# EAGLE design oresat-proto-card-Octavo (EAGLE 9.4.0)

## Sheet 1 of 3: Connectors
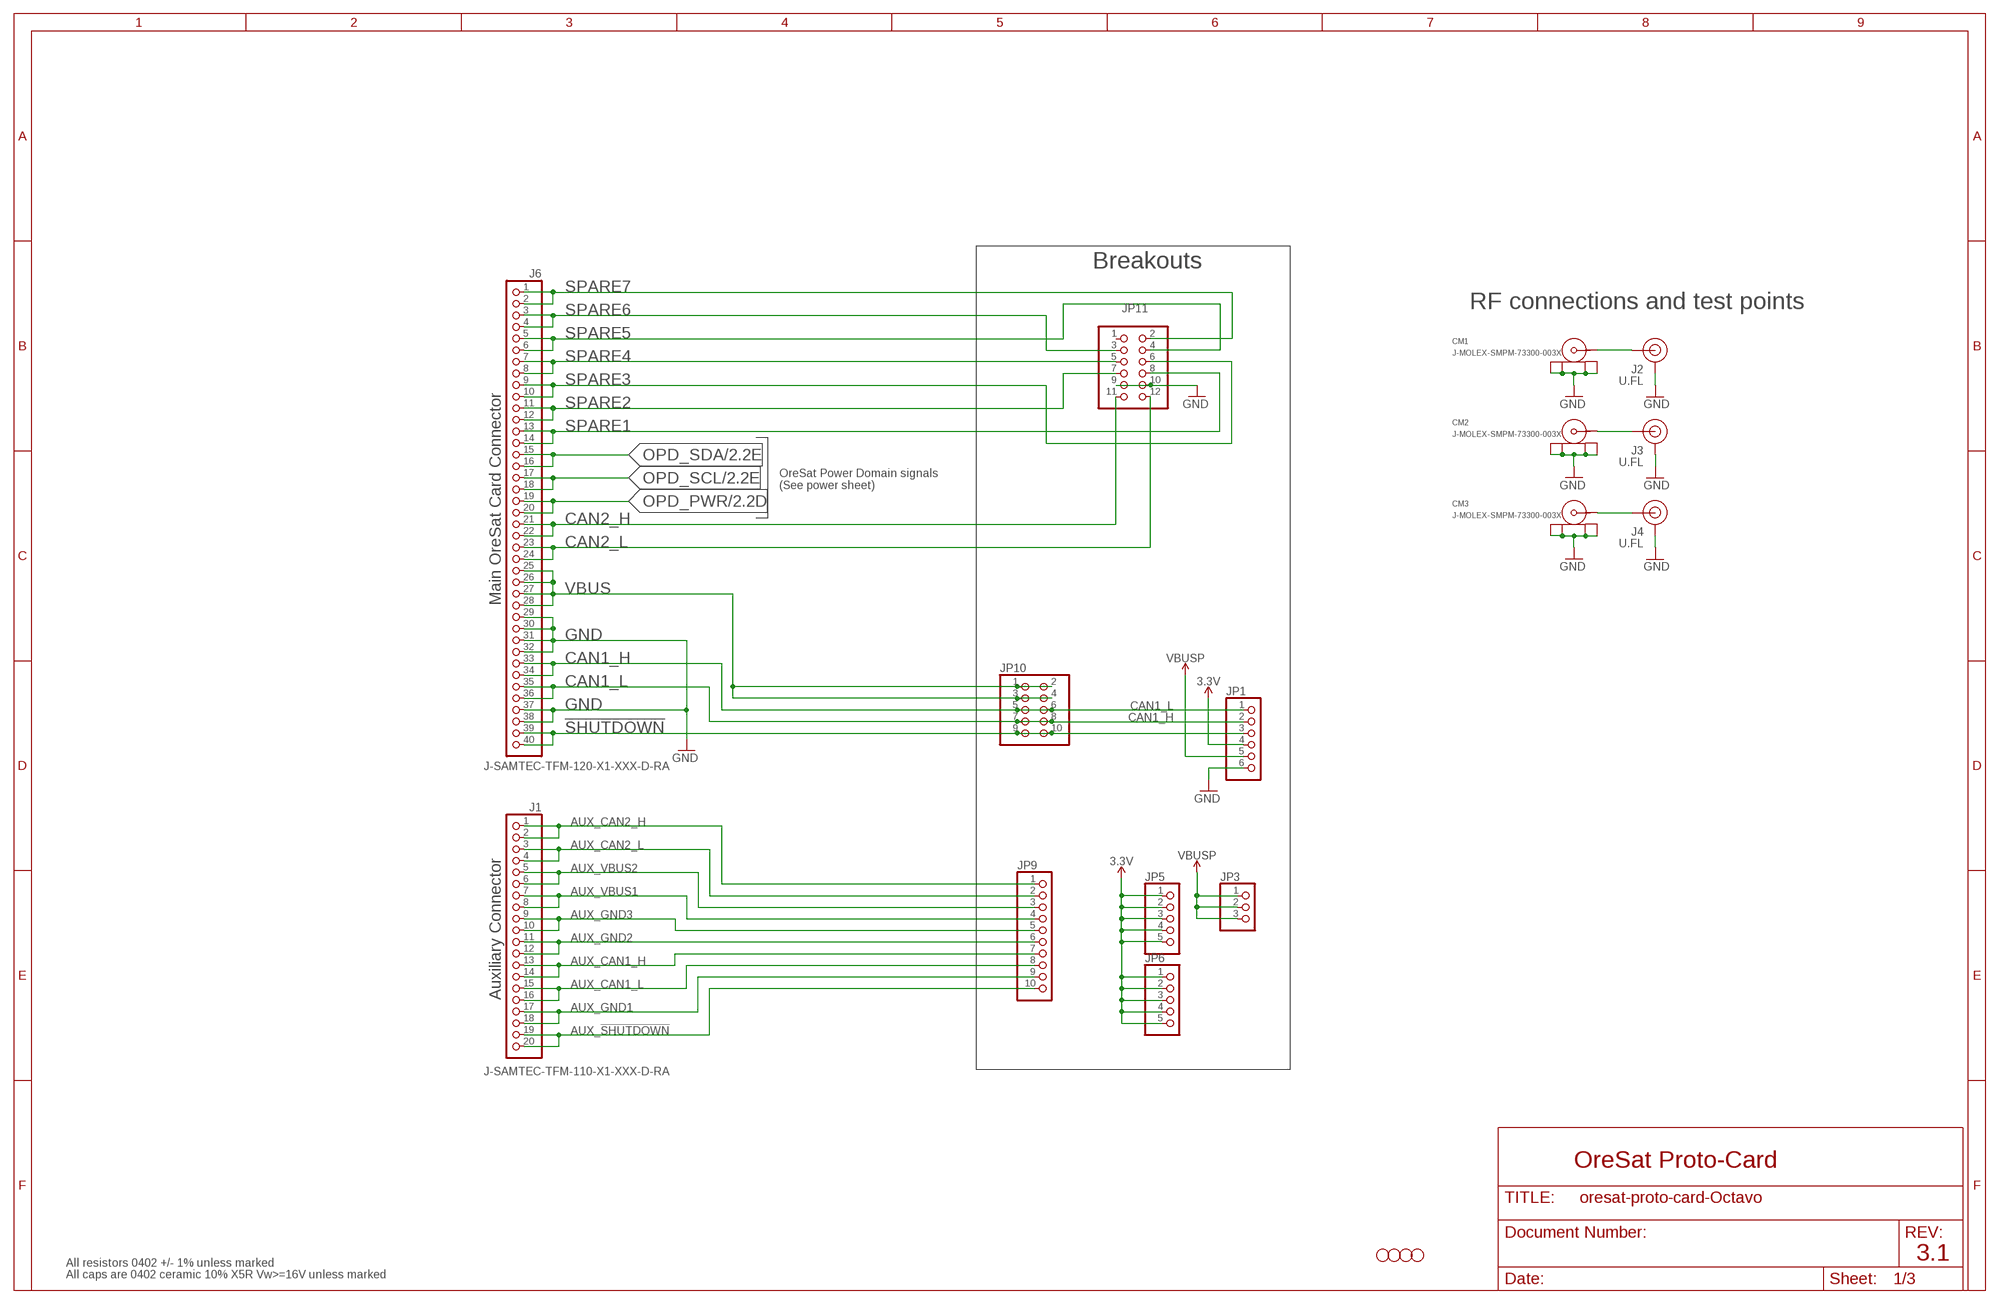
[diagram p0: schematic, sheet 1]

### Parts
CM1  J-MOLEX-SMPM-73300-003X  [J-MOLEX-SMPM-073300-003X]
CM2  J-MOLEX-SMPM-73300-003X  [J-MOLEX-SMPM-073300-003X]
CM3  J-MOLEX-SMPM-73300-003X  [J-MOLEX-SMPM-073300-003X]
H1  STAND-OFFTIGHT  [STAND-OFF-TIGHT]
H2  STAND-OFFTIGHT  [STAND-OFF-TIGHT]
H3  STAND-OFFTIGHT  [STAND-OFF-TIGHT]
H4  STAND-OFFTIGHT  [STAND-OFF-TIGHT]
J1  J-SAMTEC-TFM-110-X1-XXX-D-RA  [J-SAMTEC-TFM-110-X1-XXX-D-RA]
J2  U.FL  U.FL2PIN  [U.FL]
J3  U.FL  U.FL2PIN  [U.FL]
J4  U.FL  U.FL2PIN  [U.FL]
J6  J-SAMTEC-TFM-120-X1-XXX-D-RA  [J-SAMTEC-TFM-120-X1-XXX-D-RA]
JP1  PINHD-1X6  [1X06]
JP3  PINHD-1X3  [1X03]
JP5  PINHD-1X5  [1X05]
JP6  PINHD-1X5  [1X05]
JP9  PINHD-1X10  [1X10]
JP10  PINHD-2X5  [2X05]
JP11  PINHD-2X6  [2X06]

### Nets
3.3V: JP1.4 JP5.1 JP5.2 JP5.3 JP5.4 JP5.5 JP6.1 JP6.2 JP6.3 JP6.4 JP6.5 ; also sheet 2,3
!SHUTDOWN: J6.39 J6.40 JP1.3 JP10.9 JP10.10
AUX_!SHUTDOWN: J1.19 J1.20 JP9.10
AUX_CAN1_H: J1.13 J1.14 JP9.7
AUX_CAN1_L: J1.15 J1.16 JP9.8
AUX_CAN2_H: J1.1 J1.2 JP9.1
AUX_CAN2_L: J1.3 J1.4 JP9.2
AUX_GND1: J1.17 J1.18 JP9.9
AUX_GND2: J1.11 J1.12 JP9.6
AUX_GND3: J1.9 J1.10 JP9.5
AUX_VBUS1: J1.7 J1.8 JP9.4
AUX_VBUS2: J1.5 J1.6 JP9.3
CAN1_H: J6.33 J6.34 JP1.1 JP10.5 JP10.6 ; also sheet 3
CAN1_L: J6.35 J6.36 JP1.2 JP10.7 JP10.8 ; also sheet 3
CAN2_H: J6.21 J6.22 JP11.11
CAN2_L: J6.23 J6.24 JP11.12
GND: CM1.P$1(SHIELD3) CM1.P$2(SHIELD2) CM1.P$3(SHIELD1) CM1.P$4(SHIELD) CM2.P$1(SHIELD3) CM2.P$2(SHIELD2) CM2.P$3(SHIELD1) CM2.P$4(SHIELD) CM3.P$1(SHIELD3) CM3.P$2(SHIELD2) CM3.P$3(SHIELD1) CM3.P$4(SHIELD) J2.1(GND) J2.2(GND) J3.1(GND) J3.2(GND) J4.1(GND) J4.2(GND) J6.29 J6.30 J6.31 J6.32 J6.37 J6.38 JP1.6 JP11.9 JP11.10 ; also sheet 2,3
N$300: CM3.RF(CENTER) J4.FEED(SIGNAL)
OPD_PWR: J6.19 J6.20 ; also sheet 2
OPD_SCL: J6.17 J6.18 ; also sheet 2
OPD_SDA: J6.15 J6.16 ; also sheet 2
RF1: CM1.RF(CENTER) J2.FEED(SIGNAL)
RF2: CM2.RF(CENTER) J3.FEED(SIGNAL)
SPARE1: J6.13 J6.14 JP11.8
SPARE2: J6.11 J6.12 JP11.7
SPARE3: J6.9 J6.10 JP11.6
SPARE4: J6.7 J6.8 JP11.5
SPARE5: J6.5 J6.6 JP11.4
SPARE6: J6.3 J6.4 JP11.3
SPARE7: J6.1 J6.2 JP11.2
VBUS: J6.25 J6.26 J6.27 J6.28 JP10.1 JP10.2 JP10.3 JP10.4 ; also sheet 2
VBUSP: JP1.5 JP3.1 JP3.2 JP3.3 ; also sheet 2,3
Unconnected: JP11.1

### Notes on the sheet
- Breakouts
- RF connections and test points
- OreSat Power Domain signals
  (See power sheet)
- Main OreSat Card Connector
- Auxiliary Connector
- OreSat Proto-Card
- 3.1
- All resistors 0402 +/- 1% unless marked
- All caps are 0402 ceramic 10% X5R Vw>=16V unless marked

## Sheet 2 of 3: Power
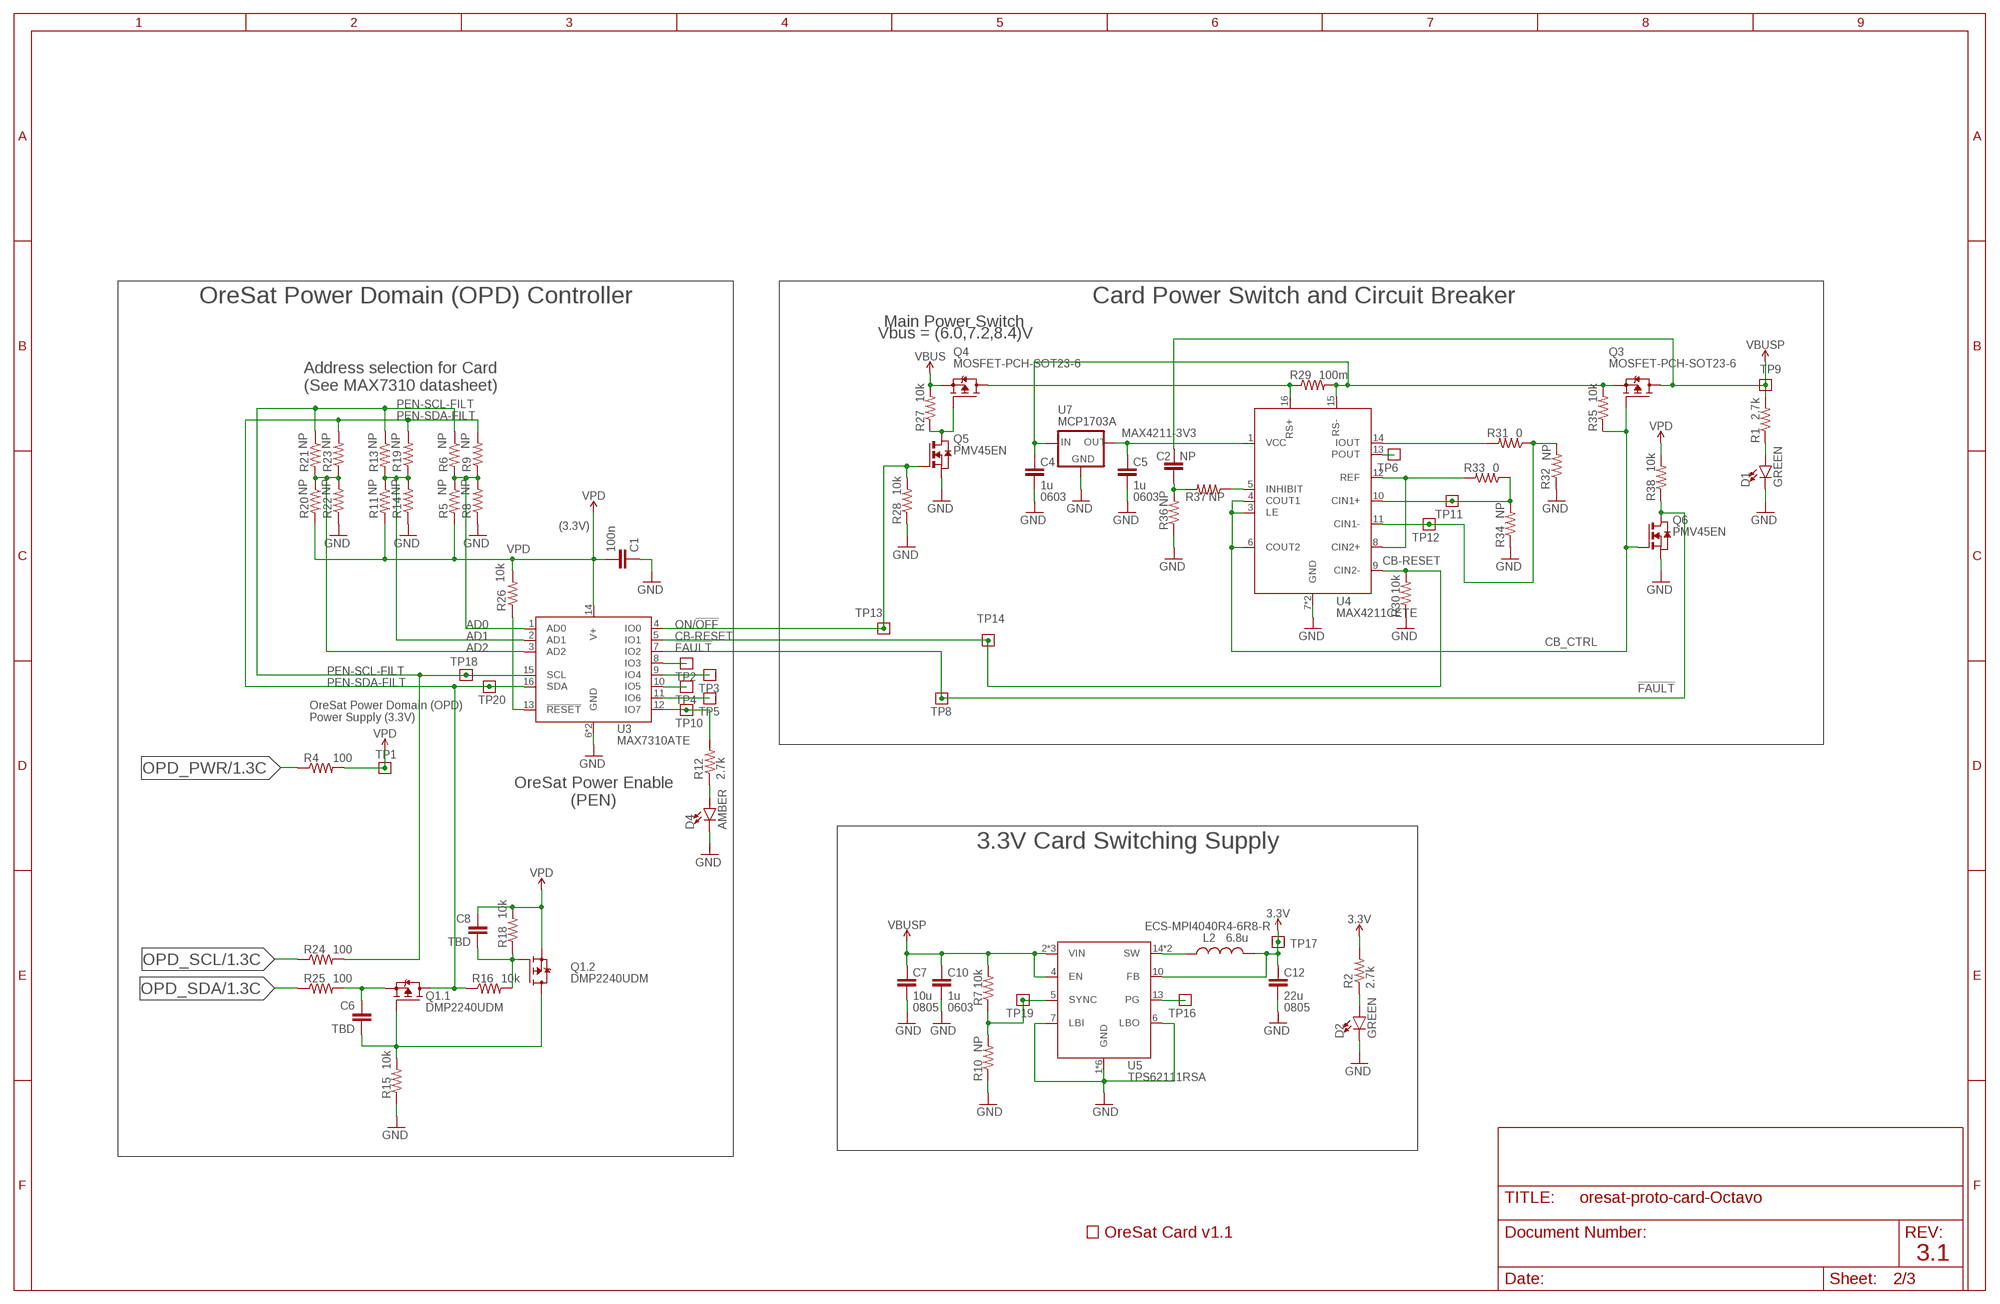
[diagram p1: schematic, sheet 2]

### Parts
C1  100n  C-EU0402-B-NOSILK  [.0402-B-NOSILK]
C2  NP  C-EU0402-B-NOSILK  [.0402-B-NOSILK]
C4  1u  C-EU0603-B-NOSILK  [.0603-B-NOSILK]
C5  1u  C-EU0603-B-NOSILK  [.0603-B-NOSILK]
C6  TBD  C-EU0402-B-NOSILK  [.0402-B-NOSILK]
C7  10u  C-EU0805-B-NOSILK  [.0805-B-NOSILK]
C8  TBD  C-EU0402-B-NOSILK  [.0402-B-NOSILK]
C10  1u  C-EU0603-B-NOSILK  [.0603-B-NOSILK]
C12  22u  C-EU0805-B-NOSILK  [.0805-B-NOSILK]
D1  GREEN  LED-GREEN0603  [LED-0603]
D2  GREEN  LED-GREEN0603  [LED-0603]
D4  AMBER  LED-GREEN0603  [LED-0603]
L2  6.8u  L-ECS-MPI4040  [ECS-MPI4040]
Q1  DMP2240UDM  MOSFET-PCH-SOT23-6  [SOT23-6]
Q3  MOSFET-PCH-SOT23-6  [SOT23-6]
Q4  MOSFET-PCH-SOT23-6  [SOT23-6]
Q5  PMV45EN  [SOT23]
Q6  PMV45EN  [SOT23]
R1  2.7k  R-US_0402-B-NOSILK  [.0402-B-NOSILK]
R2  2.7k  R-US_0402-B-NOSILK  [.0402-B-NOSILK]
R4  100  R-US_0402-B-NOSILK  [.0402-B-NOSILK]
R5  NP  R-US_0402-B-NOSILK  [.0402-B-NOSILK]
R6  NP  R-US_0402-B-NOSILK  [.0402-B-NOSILK]
R7  10k  R-US_0402-B-NOSILK  [.0402-B-NOSILK]
R8  NP  R-US_0402-B-NOSILK  [.0402-B-NOSILK]
R9  NP  R-US_0402-B-NOSILK  [.0402-B-NOSILK]
R10  NP  R-US_0402-B-NOSILK  [.0402-B-NOSILK]
R11  NP  R-US_0402-B-NOSILK  [.0402-B-NOSILK]
R12  2.7k  R-US_0402-B-NOSILK  [.0402-B-NOSILK]
R13  NP  R-US_0402-B-NOSILK  [.0402-B-NOSILK]
R14  NP  R-US_0402-B-NOSILK  [.0402-B-NOSILK]
R15  10k  R-US_0402-B-NOSILK  [.0402-B-NOSILK]
R16  10k  R-US_0402-B-NOSILK  [.0402-B-NOSILK]
R18  10k  R-US_0402-B-NOSILK  [.0402-B-NOSILK]
R19  NP  R-US_0402-B-NOSILK  [.0402-B-NOSILK]
R20  NP  R-US_0402-B-NOSILK  [.0402-B-NOSILK]
R21  NP  R-US_0402-B-NOSILK  [.0402-B-NOSILK]
R22  NP  R-US_0402-B-NOSILK  [.0402-B-NOSILK]
R23  NP  R-US_0402-B-NOSILK  [.0402-B-NOSILK]
R24  100  R-US_0402-B-NOSILK  [.0402-B-NOSILK]
R25  100  R-US_0402-B-NOSILK  [.0402-B-NOSILK]
R26  10k  R-US_0402-B-NOSILK  [.0402-B-NOSILK]
R27  10k  R-US_0402-B-NOSILK  [.0402-B-NOSILK]
R28  10k  R-US_0402-B-NOSILK  [.0402-B-NOSILK]
R29  100m  R-US_R1206  [R1206]
R30  10k  R-US_0402-B-NOSILK  [.0402-B-NOSILK]
R31  0  R-US_0402-B-NOSILK  [.0402-B-NOSILK]
R32  NP  R-US_0402-B-NOSILK  [.0402-B-NOSILK]
R33  0  R-US_0402-B-NOSILK  [.0402-B-NOSILK]
R34  NP  R-US_0402-B-NOSILK  [.0402-B-NOSILK]
R35  10k  R-US_0402-B-NOSILK  [.0402-B-NOSILK]
R36  NP  R-US_0402-B-NOSILK  [.0402-B-NOSILK]
R37  NP  R-US_0402-B-NOSILK  [.0402-B-NOSILK]
R38  10k  R-US_0402-B-NOSILK  [.0402-B-NOSILK]
TP1  TEST-POINT  [2MM-TEST-POINT]
TP2  TEST-POINT  [2MM-TEST-POINT]
TP3  TEST-POINT  [2MM-TEST-POINT]
TP4  TEST-POINT  [2MM-TEST-POINT]
TP5  TEST-POINT  [2MM-TEST-POINT]
TP6  TEST-POINT  [2MM-TEST-POINT]
TP8  TEST-POINT  [2MM-TEST-POINT]
TP9  TEST-POINT  [2MM-TEST-POINT]
TP10  TEST-POINT  [2MM-TEST-POINT]
TP11  TEST-POINT  [2MM-TEST-POINT]
TP12  TEST-POINT  [2MM-TEST-POINT]
TP13  TEST-POINT  [2MM-TEST-POINT]
TP14  TEST-POINT  [2MM-TEST-POINT]
TP16  TEST-POINT  [2MM-TEST-POINT]
TP17  TEST-POINT  [2MM-TEST-POINT]
TP18  TEST-POINT  [2MM-TEST-POINT]
TP19  TEST-POINT  [2MM-TEST-POINT]
TP20  TEST-POINT  [2MM-TEST-POINT]
U3  MAX7310ATE  MAX7310  [QFN65P400X400X80-17T210]
U4  MAX4211CETE  MAX4211  [QFN65P400X400X80-17T210]
U5  TPS62111RSA  TPS6211X  [S-PVQFN-16]
U7  MCP1703A  XC63FPM  [SOT23]
U$1  ORESAT-CARD-V1.1-3XRF  [ORESAT-CARD-V1.1-3XRF]

### Nets
3.3V: C12.1 L2.2 R2.2 TP17.1 U5.10(FB) ; also sheet 1,3
!FAULT: Q6.3(D) R38.1 TP8.1 U3.7(IO2)
AD0: R5.1 R6.2 R8.2 R9.1 U3.1(AD0)
AD1: R11.1 R13.2 R14.2 R19.1 U3.2(AD1)
AD2: R20.1 R21.2 R22.2 R23.1 U3.3(AD2)
CB-RESET: R30.2 TP14.1 U3.5(IO1) U4.9(CIN2-)
CB_CTRL: Q3.3(G) Q6.1(G) R35.1 U4.3(LE) U4.4(COUT1) U4.6(COUT2)
GND: C1.1 C4.2 C5.2 C7.2 C10.2 C12.2 D1.C D2.C D4.C Q5.2(S) Q6.2(S) R8.1 R10.1 R14.1 R15.1 R22.1 R28.1 R30.1 R32.1 R34.1 R36.1 U3.6(GND) U3.EPAD(GND) U4.7(GND) U4.EPAD(GND) U5.1(GND) U5.6(LBO) U5.7(LBI) U5.9(GND) U5.11(GND) U5.12(GND) U5.16(GND) U5.PAD(GND) U7.1(GND) ; also sheet 1,3
MAX4211-3V3: C5.1 U4.1(VCC) U7.2(OUT)
N$270: D1.A R1.1
N$271: D2.A R2.1
N$398: C4.1 Q3.4(S) R29.2 R35.2 U4.15(RS-) U7.3(IN)
N$480: TP2.1 U3.8(IO3)
N$482: TP3.1 U3.9(IO4)
N$518: TP4.1 U3.10(IO5)
N$523: TP5.1 U3.11(IO6)
N$573: R12.2 TP10.1 U3.12(IO7)
N$575: D4.A R12.1
N$579: C6.1 Q1.5(.1:S) R25.2
N$580: C6.2 Q1.1(.1:G) Q1.4(.2:D) R15.2
N$581: C8.2 Q1.3(.2:G) R16.2 R18.1
N$589: R26.1 U3.13(!RESET)
N$590: Q4.3(G) Q5.3(D) R27.1
N$593: Q4.1(D) Q4.2(D) Q4.5(D) Q4.6(D) R29.1 U4.16(RS+)
N$596: R31.1 R32.2 TP12.1 U4.11(CIN1-)
N$597: R33.1 R34.2 TP11.1 U4.10(CIN1+)
N$598: R31.2 U4.14(IOUT)
N$599: R33.2 U4.8(CIN2+) U4.12(REF)
N$600: TP6.1 U4.13(POUT)
N$603: C2.1 R36.2 R37.2
N$604: R37.1 U4.5(INHIBIT)
ON/!OFF: Q5.1(G) R28.2 TP13.1 U3.4(IO0)
OPD_PWR: R4.1 ; also sheet 1
OPD_SCL: R24.1 ; also sheet 1
OPD_SDA: R25.1 ; also sheet 1
PEN-SCL-FILT: R6.1 R13.1 R21.1 R24.2 TP18.1 U3.15(SCL)
PEN-SDA-FILT: Q1.6(.1:D) R9.2 R16.1 R19.2 R23.2 TP20.1 U3.16(SDA)
TPS62111-PG: TP16.1 U5.13(PG)
TPS62111-SYNC: R7.1 R10.2 TP19.1 U5.5(SYNC)
TPS62111_SW: L2.1 U5.14(SW) U5.15(SW)
VBUS: Q4.4(S) R27.2 ; also sheet 1
VBUSP: C2.2 C7.1 C10.1 Q3.1(D) Q3.2(D) Q3.5(D) Q3.6(D) R1.2 R7.2 TP9.1 U5.2(VIN) U5.3(VIN) U5.4(EN) U5.8(VIN) ; also sheet 1,3
VPD: C1.2 C8.1 Q1.2(.2:S) R4.2 R5.2 R11.2 R18.2 R20.2 R26.2 R38.2 TP1.1 U3.14(V+)

### Notes on the sheet
- OreSat Power Domain (OPD) Controller | Card Power Switch and Circuit Breaker
- Main Power Switch
- Vbus = (6.0,7.2,8.4)V
- Address selection for Card
  (See MAX7310 datasheet)
- 0603 | 0603
- (3.3V)
- OreSat Power Domain (OPD)
  Power Supply (3.3V)
- OreSat Power Enable
  (PEN)
- 3.3V Card Switching Supply
- ECS-MPI4040R4-6R8-R
- 0805 | 0603 | 0805
- 3.1

## Sheet 3 of 3: Microcontroller
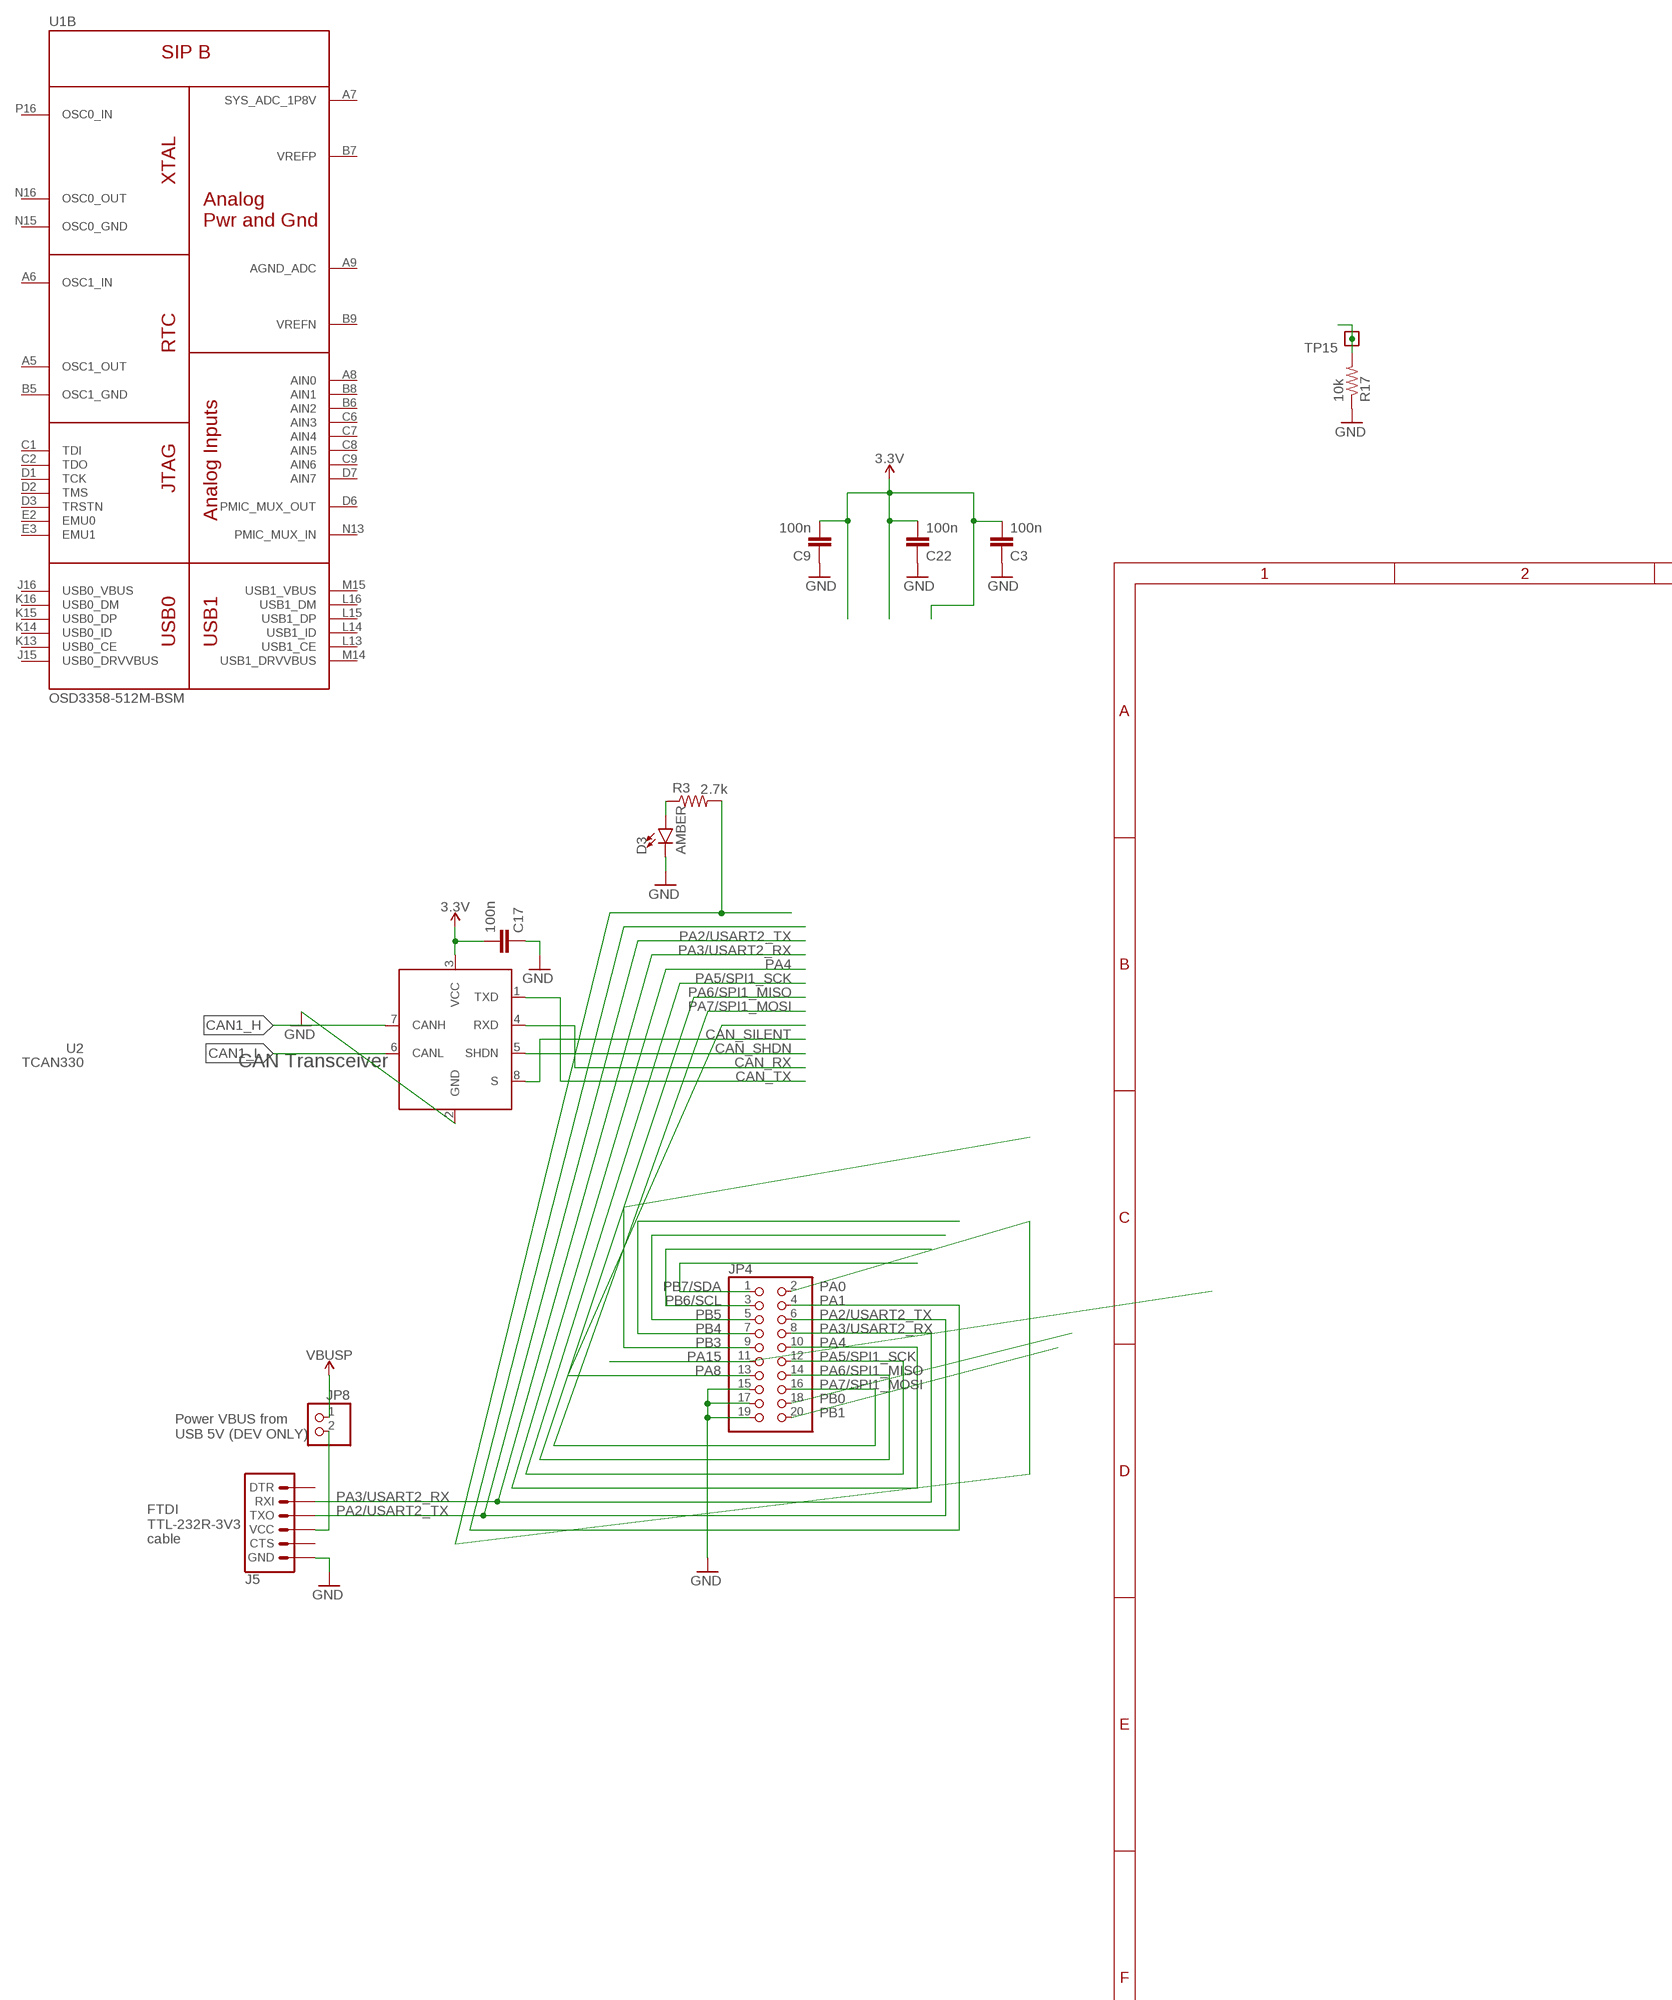
[diagram p2: schematic, sheet 3, part 1 of 2]
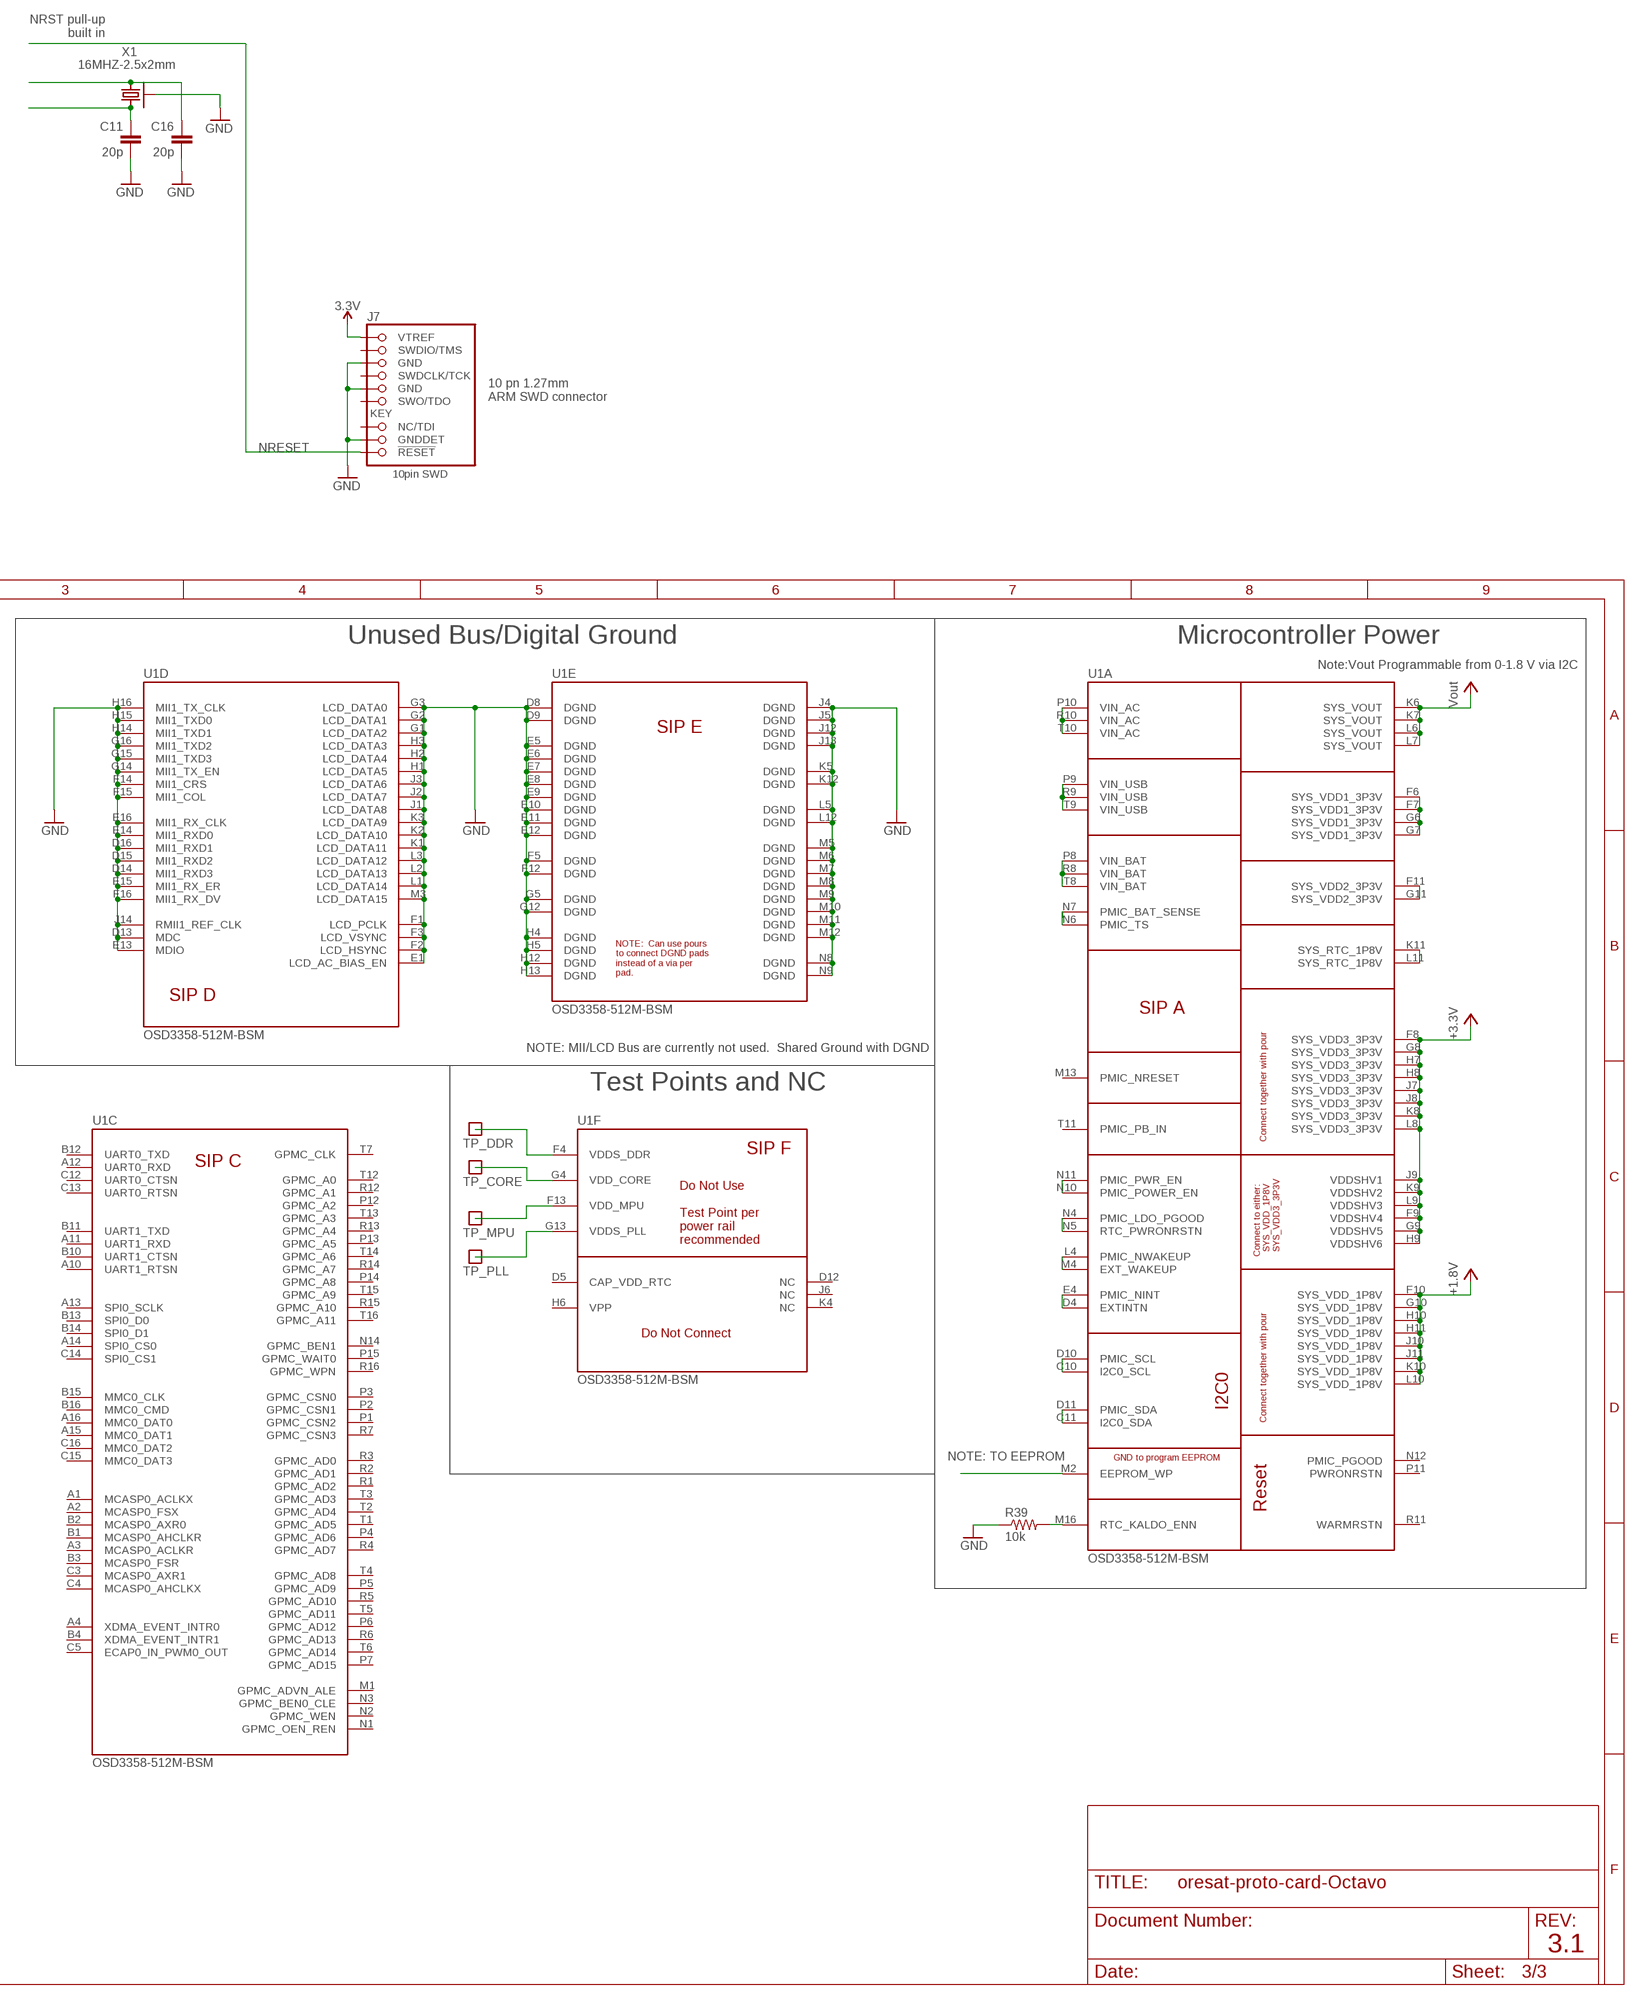
[diagram p3: schematic, sheet 3, part 2 of 2]

### Parts
C3  100n  C-EU0402-B-NOSILK  [.0402-B-NOSILK]
C9  100n  C-EU0402-B-NOSILK  [.0402-B-NOSILK]
C11  20p  C-EU0402-B-NOSILK  [.0402-B-NOSILK]
C16  20p  C-EU0402-B-NOSILK  [.0402-B-NOSILK]
C17  100n  C-EU0402-B-NOSILK  [.0402-B-NOSILK]
C22  100n  C-EU0402-B-NOSILK  [.0402-B-NOSILK]
D3  AMBER  LED-GREEN0603  [LED-0603]
J5  6_PIN_SERIAL_TARGETSILK  [6_PIN_SERIAL_TARGET_SIDE_W_SILK]
J7  FTSH-105-XX-X-DV-K  [CON10_2X5_DUK_FTSH]
JP4  PINHD-2X10  [2X10]
JP8  PINHD-1X2  [1X02]
R3  2.7k  R-US_0402-B-NOSILK  [.0402-B-NOSILK]
R17  10k  R-US_0402-B-NOSILK  [.0402-B-NOSILK]
R39  10k  R-US_R0201  [R0201]
TP15  TEST-POINT  [2MM-TEST-POINT]
TP_CORE  TEST-POINT  [2MM-TEST-POINT]
TP_DDR  TEST-POINT  [2MM-TEST-POINT]
TP_MPU  TEST-POINT  [2MM-TEST-POINT]
TP_PLL  TEST-POINT  [2MM-TEST-POINT]
U1  OSD3358-512M-BSM  [OSD335X-BGA-256]
U2  TCAN330  [SOT23-8_TI-DCN]
X1  16MHZ-2.5x2mm  CRYSTAL-WITH-GND  [CRYSTAL_2.5X2]

### Nets
3.3V: C3.2 C9.2 C17.2 C22.2 J7.1(VTREF) U2.3(VCC) ; also sheet 1,2
+3V3: U1.F8(A:SYS_VDD3_3P3V) U1.F9(A:VDDSHV4) U1.F10(A:SYS_VDD_1P8V) U1.G8(A:SYS_VDD3_3P3V) U1.G9(A:VDDSHV5) U1.G10(A:SYS_VDD_1P8V) U1.H7(A:SYS_VDD3_3P3V) U1.H8(A:SYS_VDD3_3P3V) U1.H9(A:VDDSHV6) U1.H10(A:SYS_VDD_1P8V) U1.H11(A:SYS_VDD_1P8V) U1.J7(A:SYS_VDD3_3P3V) U1.J8(A:SYS_VDD3_3P3V) U1.J9(A:VDDSHV1) U1.J10(A:SYS_VDD_1P8V) U1.J11(A:SYS_VDD_1P8V) U1.K8(A:SYS_VDD3_3P3V) U1.K9(A:VDDSHV2) U1.K10(A:SYS_VDD_1P8V) U1.L8(A:SYS_VDD3_3P3V) U1.L9(A:VDDSHV3) U1.L10(A:SYS_VDD_1P8V) ; supply symbol labelled +1.8V, +3.3V
BOOT: R17.2 TP15.1
CAN1_H: U2.7(CANH) ; also sheet 1
CAN1_L: U2.6(CANL) ; also sheet 1
CAN_RX: U2.4(RXD)
CAN_SHDN: U2.5(SHDN)
CAN_SILENT: U2.8(S)
CAN_TX: U2.1(TXD)
CRYSTALIN: C16.1 X1.1
CRYSTALOUT: C11.1 X1.3
GND: C3.1 C9.1 C11.2 C16.2 C17.1 C22.1 D3.C J5.P$6(GND) J7.3(GND) J7.5(GND) J7.9(GNDDET) JP4.15 JP4.17 JP4.19 R17.1 R39.1 U1.D8(E:DGND) U1.D9(E:DGND) U1.D13(D:MDC) U1.D14(D:MII1_RXD3) U1.D15(D:MII1_RXD2) U1.D16(D:MII1_RXD1) U1.E1(D:LCD_AC_BIAS_EN) U1.E5(E:DGND) U1.E6(E:DGND) U1.E7(E:DGND) U1.E8(E:DGND) U1.E9(E:DGND) U1.E10(E:DGND) U1.E11(E:DGND) U1.E12(E:DGND) U1.E13(D:MDIO) U1.E14(D:MII1_RXD0) U1.E15(D:MII1_RX_ER) U1.E16(D:MII1_RX_CLK) U1.F1(D:LCD_PCLK) U1.F2(D:LCD_HSYNC) U1.F3(D:LCD_VSYNC) U1.F5(E:DGND) U1.F12(E:DGND) U1.F14(D:MII1_CRS) U1.F15(D:MII1_COL) U1.F16(D:MII1_RX_DV) U1.G1(D:LCD_DATA2) U1.G2(D:LCD_DATA1) U1.G3(D:LCD_DATA0) U1.G5(E:DGND) U1.G12(E:DGND) U1.G14(D:MII1_TX_EN) U1.G15(D:MII1_TXD3) U1.G16(D:MII1_TXD2) U1.H1(D:LCD_DATA5) U1.H2(D:LCD_DATA4) U1.H3(D:LCD_DATA3) U1.H4(E:DGND) U1.H5(E:DGND) U1.H12(E:DGND) U1.H13(E:DGND) U1.H14(D:MII1_TXD1) U1.H15(D:MII1_TXD0) U1.H16(D:MII1_TX_CLK) U1.J1(D:LCD_DATA8) U1.J2(D:LCD_DATA7) U1.J3(D:LCD_DATA6) U1.J4(E:DGND) U1.J5(E:DGND) U1.J12(E:DGND) U1.J13(E:DGND) U1.J14(D:RMII1_REF_CLK) U1.K1(D:LCD_DATA11) U1.K2(D:LCD_DATA10) U1.K3(D:LCD_DATA9) U1.K5(E:DGND) U1.K12(E:DGND) U1.L1(D:LCD_DATA14) U1.L2(D:LCD_DATA13) U1.L3(D:LCD_DATA12) U1.L5(E:DGND) U1.L12(E:DGND) U1.M3(D:LCD_DATA15) U1.M5(E:DGND) U1.M6(E:DGND) U1.M7(E:DGND) U1.M8(E:DGND) U1.M9(E:DGND) U1.M10(E:DGND) U1.M11(E:DGND) U1.M12(E:DGND) U1.N8(E:DGND) U1.N9(E:DGND) U2.2(GND) X1.2(SHIELD) X1.4(SHIELD) ; also sheet 1,2
N$1: D3.A R3.1
N$2: U1.F11(A:SYS_VDD2_3P3V) U1.G11(A:SYS_VDD2_3P3V)
N$3: U1.N6(A:PMIC_TS) U1.N7(A:PMIC_BAT_SENSE)
N$4: U1.K11(A:SYS_RTC_1P8V) U1.L11(A:SYS_RTC_1P8V)
N$5: U1.D4(A:EXTINTN) U1.E4(A:PMIC_NINT)
N$6: U1.F6(A:SYS_VDD1_3P3V) U1.F7(A:SYS_VDD1_3P3V) U1.G6(A:SYS_VDD1_3P3V) U1.G7(A:SYS_VDD1_3P3V)
N$7: U1.K6(A:SYS_VOUT) U1.K7(A:SYS_VOUT) U1.L6(A:SYS_VOUT) U1.L7(A:SYS_VOUT) ; supply symbol labelled Vout
N$8: U1.P10(A:VIN_AC) U1.R10(A:VIN_AC) U1.T10(A:VIN_AC)
N$9: U1.P9(A:VIN_USB) U1.R9(A:VIN_USB) U1.T9(A:VIN_USB)
N$10: U1.P8(A:VIN_BAT) U1.R8(A:VIN_BAT) U1.T8(A:VIN_BAT)
N$11: U1.L4(A:PMIC_NWAKEUP) U1.M4(A:EXT_WAKEUP)
N$12: U1.N4(A:PMIC_LDO_PGOOD) U1.N5(A:RTC_PWRONRSTN)
N$13: U1.N10(A:PMIC_POWER_EN) U1.N11(A:PMIC_PWR_EN)
N$14: U1.C10(A:I2C0_SCL) U1.D10(A:PMIC_SCL)
N$15: U1.C11(A:I2C0_SDA) U1.D11(A:PMIC_SDA)
N$16: TP_MPU.1 U1.F13(F:VDD_MPU)
N$17: R39.2 U1.M16(A:RTC_KALDO_ENN)
N$18: U1.M2(A:EEPROM_WP)
N$19: TP_PLL.1 U1.G13(F:VDDS_PLL)
N$20: TP_CORE.1 U1.G4(F:VDD_CORE)
N$21: TP_DDR.1 U1.F4(F:VDDS_DDR)
N$406: J5.P$4(VCC) JP8.2
NRESET: J7.10(!RESET)
PA0: JP4.2 R3.2
PA1: JP4.4
PA2/USART2_TX: J5.P$2(TXO) JP4.6
PA3/USART2_RX: J5.P$3(RXI) JP4.8
PA4: JP4.10
PA5/SPI1_SCK: JP4.12
PA6/SPI1_MISO: JP4.14
PA7/SPI1_MOSI: JP4.16
PA8: JP4.13
PA15: JP4.11
PB0: JP4.18
PB1: JP4.20
PB3: JP4.9
PB4: JP4.7
PB5: JP4.5
PB6/SCL: JP4.3
PB7/SDA: JP4.1
VBUSP: JP8.1 ; also sheet 1,2
Unconnected: J5.P$1(DTR) J5.P$5(CTS) J7.2(SWDIO/TMS) J7.4(SWDCLK/TCK) J7.6(SWO/TDO) J7.8(NC/TDI) U1.A1(C:MCASP0_ACLKX) U1.A2(C:MCASP0_FSX) U1.A3(C:MCASP0_ACLKR) U1.A4(C:XDMA_EVENT_INTR0) U1.A5(B:OSC1_OUT) U1.A6(B:OSC1_IN) U1.A7(B:SYS_ADC_1P8V) U1.A8(B:AIN0) U1.A9(B:AGND_ADC) U1.A10(C:UART1_RTSN) U1.A11(C:UART1_RXD) U1.A12(C:UART0_RXD) U1.A13(C:SPI0_SCLK) U1.A14(C:SPI0_CS0) U1.A15(C:MMC0_DAT1) U1.A16(C:MMC0_DAT0) U1.B1(C:MCASP0_AHCLKR) U1.B2(C:MCASP0_AXR0) U1.B3(C:MCASP0_FSR) U1.B4(C:XDMA_EVENT_INTR1) U1.B5(B:OSC1_GND) U1.B6(B:AIN2) U1.B7(B:VREFP) U1.B8(B:AIN1) U1.B9(B:VREFN) U1.B10(C:UART1_CTSN) U1.B11(C:UART1_TXD) U1.B12(C:UART0_TXD) U1.B13(C:SPI0_D0) U1.B14(C:SPI0_D1) U1.B15(C:MMC0_CLK) U1.B16(C:MMC0_CMD) U1.C1(B:TDI) U1.C2(B:TDO) U1.C3(C:MCASP0_AXR1) U1.C4(C:MCASP0_AHCLKX) U1.C5(C:ECAP0_IN_PWM0_OUT) U1.C6(B:AIN3) U1.C7(B:AIN4) U1.C8(B:AIN5) U1.C9(B:AIN6) U1.C12(C:UART0_CTSN) U1.C13(C:UART0_RTSN) U1.C14(C:SPI0_CS1) U1.C15(C:MMC0_DAT3) U1.C16(C:MMC0_DAT2) U1.D1(B:TCK) U1.D2(B:TMS) U1.D3(B:TRSTN) U1.D5(F:CAP_VDD_RTC) U1.D6(B:PMIC_MUX_OUT) U1.D7(B:AIN7) U1.D12(F:NC) U1.E2(B:EMU0) U1.E3(B:EMU1) U1.H6(F:VPP) U1.J6(F:NC) U1.J15(B:USB0_DRVVBUS) U1.J16(B:USB0_VBUS) U1.K4(F:NC) U1.K13(B:USB0_CE) U1.K14(B:USB0_ID) U1.K15(B:USB0_DP) U1.K16(B:USB0_DM) U1.L13(B:USB1_CE) U1.L14(B:USB1_ID) U1.L15(B:USB1_DP) U1.L16(B:USB1_DM) U1.M1(C:GPMC_ADVN_ALE) U1.M13(A:PMIC_NRESET) U1.M14(B:USB1_DRVVBUS) U1.M15(B:USB1_VBUS) U1.N1(C:GPMC_OEN_REN) U1.N2(C:GPMC_WEN) U1.N3(C:GPMC_BEN0_CLE) U1.N12(A:PMIC_PGOOD) U1.N13(B:PMIC_MUX_IN) U1.N14(C:GPMC_BEN1) U1.N15(B:OSC0_GND) U1.N16(B:OSC0_OUT) U1.P1(C:GPMC_CSN2) U1.P2(C:GPMC_CSN1) U1.P3(C:GPMC_CSN0) U1.P4(C:GPMC_AD6) U1.P5(C:GPMC_AD9) U1.P6(C:GPMC_AD12) U1.P7(C:GPMC_AD15) U1.P11(A:PWRONRSTN) U1.P12(C:GPMC_A2) U1.P13(C:GPMC_A5) U1.P14(C:GPMC_A8) U1.P15(C:GPMC_WAIT0) U1.P16(B:OSC0_IN) U1.R1(C:GPMC_AD2) U1.R2(C:GPMC_AD1) U1.R3(C:GPMC_AD0) U1.R4(C:GPMC_AD7) U1.R5(C:GPMC_AD10) U1.R6(C:GPMC_AD13) U1.R7(C:GPMC_CSN3) U1.R11(A:WARMRSTN) U1.R12(C:GPMC_A1) U1.R13(C:GPMC_A4) U1.R14(C:GPMC_A7) U1.R15(C:GPMC_A10) U1.R16(C:GPMC_WPN) U1.T1(C:GPMC_AD5) U1.T2(C:GPMC_AD4) U1.T3(C:GPMC_AD3) U1.T4(C:GPMC_AD8) U1.T5(C:GPMC_AD11) U1.T6(C:GPMC_AD14) U1.T7(C:GPMC_CLK) U1.T11(A:PMIC_PB_IN) U1.T12(C:GPMC_A0) U1.T13(C:GPMC_A3) U1.T14(C:GPMC_A6) U1.T15(C:GPMC_A9) U1.T16(C:GPMC_A11)

### Notes on the sheet
- NRST pull-up
  built in
- 10 pn 1.27mm 
  ARM SWD connector
- Unused Bus/Digital Ground | Microcontroller Power
- Note:Vout Programmable from 0-1.8 V via I2C
- CAN Transceiver
- NOTE: MII/LCD Bus are currently not used.  Shared Ground with DGND
- Test Points and NC
- Power VBUS from
  USB 5V (DEV ONLY)
- NOTE: TO EEPROM
- FTDI 
  TTL-232R-3V3
  cable
- 3.1

## Library data of the parts
C1-C3 C6 C8 C9 C17 C22 = rcl_custom:C-EU: CAPACITOR, European symbol; DIS: Digi-Key; DPN: 1276-1001-1-ND; MFR: Samsung; MPN: CL05B104KO5NNNC
C4 C5 C10 = oresat-rcl:C-EU: CAPACITOR, European symbol; DIS: Digi-Key; DPN: 1276-1001-1-ND; MFR: Samsung; MPN: CL05B104KO5NNNC
C7 C12 = oresat-rcl:C-EU: CAPACITOR, European symbol
C11 C16 = rcl_custom:C-EU: CAPACITOR, European symbol; DIS: Digi-Key; DPN: 1276-6601-1-ND; MFR: Samsung; MPN: CL05C200JB51PNC
CM1-CM3 = J-Molex-SMPM-73300-003X:J-MOLEX-SMPM-73300-003X; MFR: Molex; MPN: 73300-0020
D1 D2 = SparkFun-LED:LED-GREEN: Green SMD LED Used in manufacturing of various products at SparkFun Packages: 0603 - SMD 0603 package [Product Link] <http://www.futureelectronics.com/en/technologies/semiconductors/optoelectronics/leds/Pages/9894312-LTST-C190GKT.aspx?CrossPart=HSMG-C190&IM=0> LilyPad 1206 - SMD1206 LilyPad package [Product Link] <http://www.futureelectronics.com/en/Technologies/Product.aspx?ProductID=IN150NGHARVATEKCORPORATION2049943&IM=0> 1206 - SMD1206 package [Product Link] <http://www.futureelectronics.com/en/technologies/semiconductors/optoelectronics/leds/Pages/8315665-LTST-C150KGKT.aspx?IM=0> 1206 Bottom Mount -SMD 1206 Bottom Mount [Product Link] <http://www.digikey.com/product-detail/en/lite-on-inc/LTST-C230KGKT/160-1456-1-ND/386854> SparkFun Products: Pro Mini 328 -5V <https://www.sparkfun.com/products/821> RedBoard <https://www.sparkfun.com/products/12757> MP3 Trigger <https://www.sparkfun.com/products/13720> Makey Makey <https://www.sparkfun.com/products/11076>
D3 = SparkFun-LED:LED-GREEN: Green SMD LED Used in manufacturing of various products at SparkFun Packages: 0603 - SMD 0603 package [Product Link] <http://www.futureelectronics.com/en/technologies/semiconductors/optoelectronics/leds/Pages/9894312-LTST-C190GKT.aspx?CrossPart=HSMG-C190&IM=0> LilyPad 1206 - SMD1206 LilyPad package [Product Link] <http://www.futureelectronics.com/en/Technologies/Product.aspx?ProductID=IN150NGHARVATEKCORPORATION2049943&IM=0> 1206 - SMD1206 package [Product Link] <http://www.futureelectronics.com/en/technologies/semiconductors/optoelectronics/leds/Pages/8315665-LTST-C150KGKT.aspx?IM=0> 1206 Bottom Mount -SMD 1206 Bottom Mount [Product Link] <http://www.digikey.com/product-detail/en/lite-on-inc/LTST-C230KGKT/160-1456-1-ND/386854> SparkFun Products: Pro Mini 328 -5V <https://www.sparkfun.com/products/821> RedBoard <https://www.sparkfun.com/products/12757> MP3 Trigger <https://www.sparkfun.com/products/13720> Makey Makey <https://www.sparkfun.com/products/11076>; PROD_ID: DIO-00821; VALUE: GREEN
D4 = SparkFun-LED:LED-GREEN: Green SMD LED Used in manufacturing of various products at SparkFun Packages: 0603 - SMD 0603 package [Product Link] <http://www.futureelectronics.com/en/technologies/semiconductors/optoelectronics/leds/Pages/9894312-LTST-C190GKT.aspx?CrossPart=HSMG-C190&IM=0> LilyPad 1206 - SMD1206 LilyPad package [Product Link] <http://www.futureelectronics.com/en/Technologies/Product.aspx?ProductID=IN150NGHARVATEKCORPORATION2049943&IM=0> 1206 - SMD1206 package [Product Link] <http://www.futureelectronics.com/en/technologies/semiconductors/optoelectronics/leds/Pages/8315665-LTST-C150KGKT.aspx?IM=0> 1206 Bottom Mount -SMD 1206 Bottom Mount [Product Link] <http://www.digikey.com/product-detail/en/lite-on-inc/LTST-C230KGKT/160-1456-1-ND/386854> SparkFun Products: Pro Mini 328 -5V <https://www.sparkfun.com/products/821> RedBoard <https://www.sparkfun.com/products/12757> MP3 Trigger <https://www.sparkfun.com/products/13720> Makey Makey <https://www.sparkfun.com/products/11076>; VALUE: GREEN
H1-H4 = SparkFun-Hardware:STAND-OFF: Stand Off Drill holes for mechanically mounting via screws, standoffs, etc. Note: Use the keepout ring to avoid running the screw head into surrounding components. Variant Overviews STAND-OFF - Mechanical footprint for a #4 phillips button head screw. STAND-OFF-TIGHT - Mechanical footprint for a #4 phillips button head screw, Example SparkFun Products Screw - Phillips Head (1/4", 4-40, 10 pack) <https://www.sparkfun.com/products/10453> (PRT-10453) Screw - Phillips Head (1/2", 4-40, 10 pack) <https://www.sparkfun.com/products/10452> (PRT-10452) Screw - Phillips Head (3/4", 4-40, 10 pack) <https://www.sparkfun.com/products/10451> (PRT-10451) Screw - Phillips Head (1", 4-40, 10 pack) <https://www.sparkfun.com/products/10450> (PRT-10450)
J1 = J-Samtec-TFM-110-X1-XXX-D-RA:J-SAMTEC-TFM-110-X1-XXX-D-RA; MFR: Samtec; MPN: TFM-110-01-L-D-RA
J2-J4 = SparkFun-Connectors:U.FL2PIN: SMD Antenna Connector - U.FL 2mm height, 3.0mm x 3.0mm receptacle size. SparkFun Products: SparkFun WiFi Shield - ESP8266 <https://www.sparkfun.com/products/13287> SparkFun ESP8266 Thing <https://www.sparkfun.com/products/13231> SparkFun MiniGen - Pro Mini Signal Generator Shield <https://www.sparkfun.com/products/11420>; PROD_ID: CONN-09193; SF_ID: WRL-09144
J5 = SparkFun-Connectors:6_PIN_SERIAL_TARGET: 6-pin header connection for use with the "FTDI BASIC" pinout - TARGET SIDE. Also known as "Arduino Serial Program Header". It is used to mate with our FTDI Basic serial programmers using the Arduino IDE. Note, this device has "TARGET" in the name. It is intended to be used on a design that contains a target micro-controller that you wish to program. The "sister" device, named "CABLE" is inteneded to be used on a design that usually lives on the end of your USB cable and prvides the converter chip (FTDI232 or FTDI231x) to commnicate serial RX/TX. You can populate with some of these: Break Away Headers - Straight <https://www.sparkfun.com/products/116> (PRT-00116) For reference (or to suit your programming needs) check out these designs: SparkFun FTDI Basic Breakout - 5V <https://www.sparkfun.com/products/9716> (DEV-09716) SparkFun FTDI Basic Breakout - 3.3V <https://www.sparkfun.com/products/9873> (DEV-09873) SparkFun FTDI SmartBasic <https://www.sparkfun.com/products/12935> (DEV-12935) SparkFun Beefy 3 - FTDI Basic Breakout <https://www.sparkfun.com/products/13746> (DEV-13746)
J6 = J-Samtec-TFM-120-X1-XXX-D-RA:J-SAMTEC-TFM-120-X1-XXX-D-RA; MFR: Samtec; MPN: TFM-120-01-L-D-RA
J7 = J-Samtec-FTSH-105-XXX-DV-K-ARM-SWD:FTSH-105-XX-X-DV-K; MFR: Samtec; MPN: FTSH-105-01-F-DV-K
JP1 = pinhead:PINHD-1X6: PIN HEADER
JP3 = pinhead:PINHD-1X3: PIN HEADER
JP4 = pinhead:PINHD-2X10: PIN HEADER
JP5 JP6 = pinhead:PINHD-1X5: PIN HEADER
JP8 = pinhead:PINHD-1X2: PIN HEADER
JP9 = pinhead:PINHD-1X10: PIN HEADER
JP10 = pinhead:PINHD-2X5: PIN HEADER
JP11 = pinhead:PINHD-2X6: PIN HEADER
L2 = L-ECS-MPI4040:L-ECS-MPI4040; MFR: ECS; MPN: ECS-MPI4040R4-6R8-R
Q1 = Q-MOSFET-PCH-dual-SOT23-6:MOSFET-PCH-SOT23-6: Dual P channel MOSFETs in an SOT23-6; MFR: Diodes Inc; MPN: DMP2240UDM
Q3 Q4 = Q-MOSFET-PCH-SOT23-6:MOSFET-PCH-SOT23-6: P channel MOSFET in an SOT23-6; MFR: Diodes Inc; MPN: DMP3050LVT-7
Q5 Q6 = Tova:PMV45EN
R1-R28 R30-R38 = rcl_custom:R-US_: RESISTOR, American symbol; DIS: Digi-Key; DPN: 1276-4275-1-ND; MFR: Samsung; MPN: RC1005F6653CS
R29 R39 = rcl:R-US_: RESISTOR, American symbol; SPICEPREFIX: R
TP1-TP6 TP8-TP20 TP_CORE TP_DDR TP_MPU TP_PLL = Tova:TEST-POINT
U1 = U-OSD3358-512M-BSM:OSD3358-512M-BSM: Octavo Systems LLC OSD335x Family SiP: 21mm x 21mm, 1.27mm pitch 256 pin BGA contains AM3358, 512MB DDR3, TPS65217, TL5209, 4KB EEPROM and passives. Commerical Temperature (case): 0C to 85C.; DESCRIPTION: 21mm 256 Ball Bga; DIGI-KEY_PART_NUMBER: 1676-1002-ND; DIGI-KEY_PURCHASE_URL: https://www.digikey.com/product-detail/en/octavo-systems-llc/OSD3358-512M-BSM/1676-1002-ND/7644258?utm_source=snapeda&utm_medium=aggregator&utm_campaign=symbol; MF: Octavo Systems; MP: OSD3358-512M-BSM; PACKAGE: BGA-400 Octavo Systems
U2 = TCAN330:TCAN330; MFR: Texas Instruments; MPN: TCAN330GDCNT
U3 = U-Maxim-MAX7310-I2C-GPIO-expander:MAX7310; MFR: Maxim; MPN: MAX7310ATE
U4 = U-Maxim-MAX4211-power-monitor:MAX4211; MFR: Maxim; MPN: MAX4211CETE
U5 = U-TI-TPS6211x-SPS-buck:TPS6211X: TPS6211x 17-V, 1.5-A, Synchronous Step-Down Converter; MFR: TI; MPN: TPS62111RSA
U7 = v-reg:XC63FP: Positiv Voltage Regulators www.torex.co.jp/english/product/pro02/pdf/0201_xc62fp.pdf; MFR: Microchip; MPN: MCP1703AT-3302E/CB
U$1 = oresat-cards:ORESAT-CARD-V1.1
X1 = low-gain-radio:CRYSTAL-WITH-GND; DIS: Digi-Key; DPN: XC2181CT-ND; MFR: ECS Inc.; MPN: ECS-160-10-36Q-ES-TR

## Board
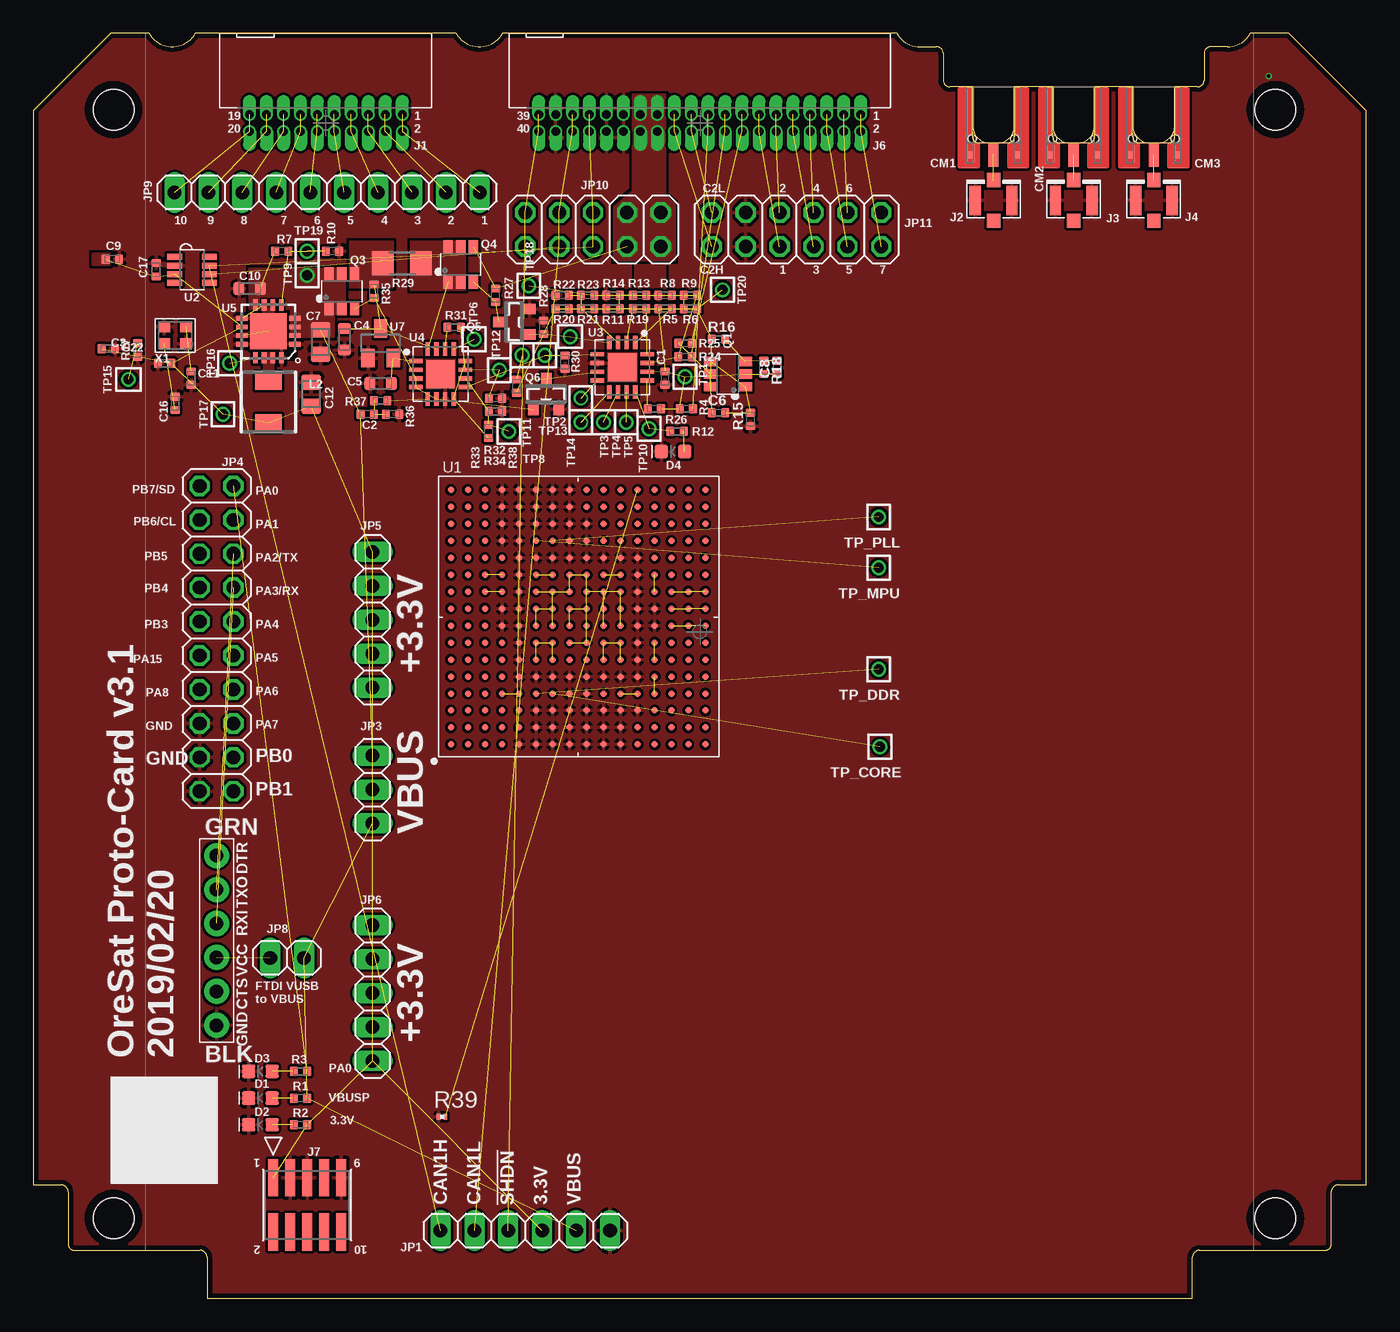
[diagram p4: board, top side]
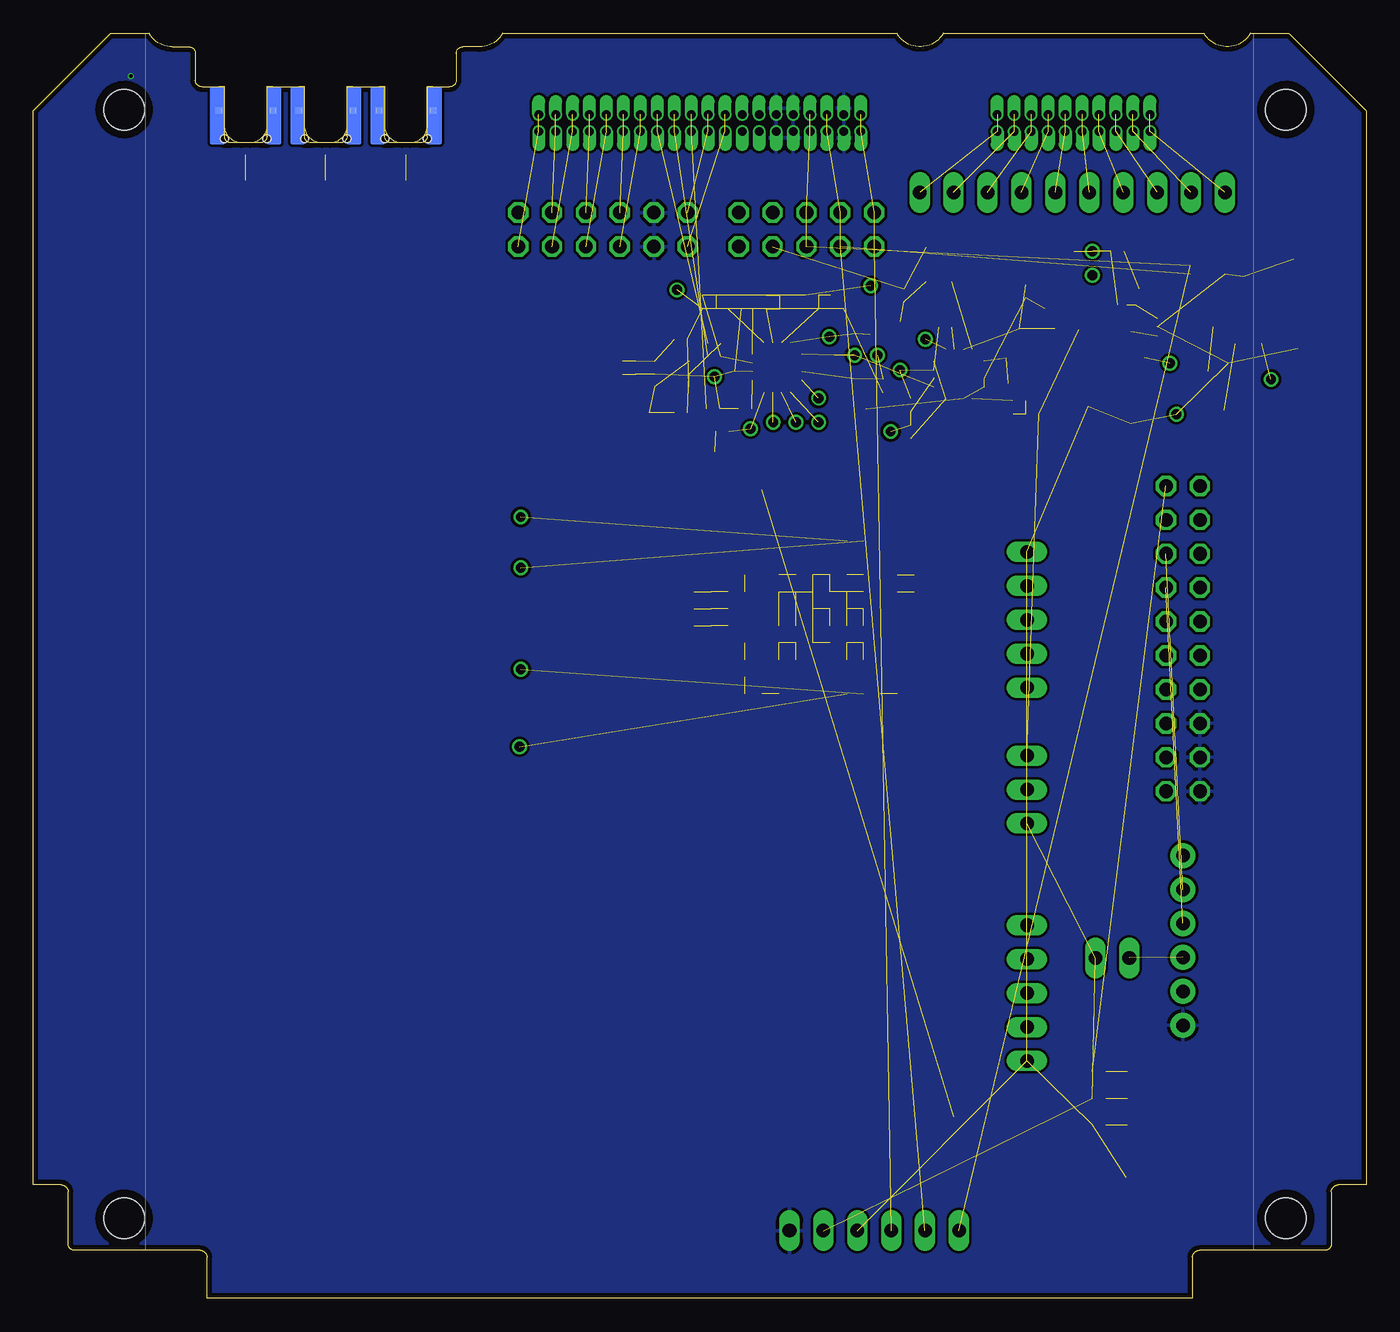
[diagram p5: board, bottom side, seen from below]

Size 99.8 x 94.7 mm. Coordinates in mm from the lower left corner, seen from the top.
Copper layers (1*2*15*16): Top 0.035559375mm / dielectric 0.17018125mm / Route2 0.01778125mm / dielectric 47mil / route 0.01778125mm / dielectric 0.17018125mm / Bottom 0.035559375mm
Design rules "oshpark4layer": minimum track width 5mil, minimum drill 10mil, track to track 5mil, track to pad 5mil, pad to pad 5mil, via to via 5mil, smd to smd 5mil, copper to edge 15mil, drill to drill 6mil, minimum pad ring 4mil, minimum via ring 4mil, stop-mask expansion 2.5mil, vias tented up to drill 0mil, thermal gap 10mil

### Footprints (pad centres in the part's own frame; a part is rotated, then mirrored left to right if it is on the bottom)
.0402-B-NOSILK = smd 0.6 x 0.7: 1 -0.5,0; 2 0.5,0
.0603-B-NOSILK = smd 0.8 x 0.95: 1 -0.8,0; 2 0.8,0
.0805-B-NOSILK = smd 1.15 x 1.45: 1 -0.9,0; 2 0.9,0
J-MOLEX-SMPM-073300-003X = smd 0.508 x 0.508: P$1 -1.778,-5.08; P$2 1.778,-5.08 | smd 0.508 x 0.508 bottom: P$3 -2.032,-1.778; P$4 2.032,-1.778 | smd 0.762 x 1.778: RF 0,-5.08 | hole 0.61: 1.587,-3.886; -1.587,-3.886
LED-0603 = smd 1 x 1: A -0.877,0; C 0.877,0
STAND-OFF-TIGHT = hole 3.048: 0,0
J-SAMTEC-TFM-110-X1-XXX-D-RA = drill 0.635 pad 0.965 offset: 1 5.715,0.635; 2 5.715,-0.635; 3 4.445,0.635; 4 4.445,-0.635; 5 3.175,0.635; 6 3.175,-0.635; 7 1.905,0.635; 8 1.905,-0.635; 9 0.635,0.635; 10 0.635,-0.635; 11 -0.635,0.635; 12 -0.635,-0.635; 13 -1.905,0.635; 14 -1.905,-0.635; 15 -3.175,0.635; 16 -3.175,-0.635; 17 -4.445,0.635; 18 -4.445,-0.635; 19 -5.715,0.635; 20 -5.715,-0.635
U.FL = smd 2.2 x 0.85: 1 0,1.375; 2 0,-1.375 | smd 1.05 x 1: FEED 1.525,0; NC -1.525,0
6_PIN_SERIAL_TARGET_SIDE_W_SILK = drill 1.016 pad 1.88: P$1 -6.35,0; P$2 -3.81,0; P$3 -1.27,0; P$4 1.27,0; P$5 3.81,0; P$6 6.35,0
J-SAMTEC-TFM-120-X1-XXX-D-RA = drill 0.635 pad 0.965 offset: 1 12.065,0.635; 2 12.065,-0.635; 3 10.795,0.635; 4 10.795,-0.635; 5 9.525,0.635; 6 9.525,-0.635; 7 8.255,0.635; 8 8.255,-0.635; 9 6.985,0.635; 10 6.985,-0.635; 11 5.715,0.635; 12 5.715,-0.635; 13 4.445,0.635; 14 4.445,-0.635; 15 3.175,0.635; 16 3.175,-0.635; 17 1.905,0.635; 18 1.905,-0.635; 19 0.635,0.635; 20 0.635,-0.635; 21 -0.635,0.635; 22 -0.635,-0.635; 23 -1.905,0.635; 24 -1.905,-0.635; 25 -3.175,0.635; 26 -3.175,-0.635; 27 -4.445,0.635; 28 -4.445,-0.635; 29 -5.715,0.635; 30 -5.715,-0.635; 31 -6.985,0.635; 32 -6.985,-0.635; 33 -8.255,0.635; 34 -8.255,-0.635; 35 -9.525,0.635; 36 -9.525,-0.635; 37 -10.795,0.635; 38 -10.795,-0.635; 39 -12.065,0.635; 40 -12.065,-0.635
CON10_2X5_DUK_FTSH = smd 0.762 x 2.794: 1 2.54,-2.032; 2 2.54,2.032; 3 1.27,-2.032; 4 1.27,2.032; 5 0,-2.032; 6 0,2.032; 7 -1.27,-2.032; 8 -1.27,2.032; 9 -2.54,-2.032; 10 -2.54,2.032
1X06 = drill 1.016 long: 1 -6.35,0; 2 -3.81,0; 3 -1.27,0; 4 1.27,0; 5 3.81,0; 6 6.35,0
1X03 = drill 1.016 long: 1 -2.54,0; 2 0,0; 3 2.54,0
2X10 = drill 1.016 octagon: 1 -11.43,-1.27; 2 -11.43,1.27; 3 -8.89,-1.27; 4 -8.89,1.27; 5 -6.35,-1.27; 6 -6.35,1.27; 7 -3.81,-1.27; 8 -3.81,1.27; 9 -1.27,-1.27; 10 -1.27,1.27; 11 1.27,-1.27; 12 1.27,1.27; 13 3.81,-1.27; 14 3.81,1.27; 15 6.35,-1.27; 16 6.35,1.27; 17 8.89,-1.27; 18 8.89,1.27; 19 11.43,-1.27; 20 11.43,1.27
1X05 = drill 1.016 long: 1 -5.08,0; 2 -2.54,0; 3 0,0; 4 2.54,0; 5 5.08,0
1X02 = drill 1.016 long: 1 -1.27,0; 2 1.27,0
1X10 = drill 1.016 long: 1 -11.43,0; 2 -8.89,0; 3 -6.35,0; 4 -3.81,0; 5 -1.27,0; 6 1.27,0; 7 3.81,0; 8 6.35,0; 9 8.89,0; 10 11.43,0
2X05 = drill 1.016 octagon: 1 -5.08,-1.27; 2 -5.08,1.27; 3 -2.54,-1.27; 4 -2.54,1.27; 5 0,-1.27; 6 0,1.27; 7 2.54,-1.27; 8 2.54,1.27; 9 5.08,-1.27; 10 5.08,1.27
2X06 = drill 1.016 octagon: 1 -6.35,-1.27; 2 -6.35,1.27; 3 -3.81,-1.27; 4 -3.81,1.27; 5 -1.27,-1.27; 6 -1.27,1.27; 7 1.27,-1.27; 8 1.27,1.27; 9 3.81,-1.27; 10 3.81,1.27; 11 6.35,-1.27; 12 6.35,1.27
ECS-MPI4040 = smd 2 x 1.3: 1 0,1.575; 2 0,-1.575
SOT23-6 = smd 0.7 x 1: 1 -0.95,-1.3; 2 0,-1.3; 3 0.95,-1.3; 4 0.95,1.3; 5 0,1.3; 6 -0.95,1.3
SOT23 = smd 0.787 x 0.889: 1 -0.953,-1.143; 2 0.953,-1.143; 3 0,1.143
R1206 = smd 1.6 x 1.803: 1 -1.422,0; 2 1.422,0
R0201 = smd 0.28 x 0.43: 1 -0.255,0; 2 0.255,0
2MM-TEST-POINT = drill 0.737: 1 0,0
OSD335X-BGA-256 = smd 0.5 x 0.5: A1 -9.525,-9.525; A2 -9.525,-8.255; A3 -9.525,-6.985; A4 -9.525,-5.715; A5 -9.525,-4.445; A6 -9.525,-3.175; A7 -9.525,-1.905; A8 -9.525,-0.635; A9 -9.525,0.635; A10 -9.525,1.905; A11 -9.525,3.175; A12 -9.525,4.445; A13 -9.525,5.715; A14 -9.525,6.985; A15 -9.525,8.255; A16 -9.525,9.525; B1 -8.255,-9.525; B2 -8.255,-8.255; B3 -8.255,-6.985; B4 -8.255,-5.715; B5 -8.255,-4.445; B6 -8.255,-3.175; B7 -8.255,-1.905; B8 -8.255,-0.635; B9 -8.255,0.635; B10 -8.255,1.905; B11 -8.255,3.175; B12 -8.255,4.445; B13 -8.255,5.715; B14 -8.255,6.985; B15 -8.255,8.255; B16 -8.255,9.525; C1 -6.985,-9.525; C2 -6.985,-8.255; C3 -6.985,-6.985; C4 -6.985,-5.715; C5 -6.985,-4.445; C6 -6.985,-3.175; C7 -6.985,-1.905; C8 -6.985,-0.635; C9 -6.985,0.635; C10 -6.985,1.905; C11 -6.985,3.175; C12 -6.985,4.445; C13 -6.985,5.715; C14 -6.985,6.985; C15 -6.985,8.255; C16 -6.985,9.525; D1 -5.715,-9.525; D2 -5.715,-8.255; D3 -5.715,-6.985; D4 -5.715,-5.715; D5 -5.715,-4.445; D6 -5.715,-3.175; D7 -5.715,-1.905; D8 -5.715,-0.635; D9 -5.715,0.635; D10 -5.715,1.905; D11 -5.715,3.175; D12 -5.715,4.445; D13 -5.715,5.715; D14 -5.715,6.985; D15 -5.715,8.255; D16 -5.715,9.525; E1 -4.445,-9.525; E2 -4.445,-8.255; E3 -4.445,-6.985; E4 -4.445,-5.715; E5 -4.445,-4.445; E6 -4.445,-3.175; E7 -4.445,-1.905; E8 -4.445,-0.635; E9 -4.445,0.635; E10 -4.445,1.905; E11 -4.445,3.175; E12 -4.445,4.445; E13 -4.445,5.715; E14 -4.445,6.985; E15 -4.445,8.255; E16 -4.445,9.525; F1 -3.175,-9.525; F2 -3.175,-8.255; F3 -3.175,-6.985; F4 -3.175,-5.715; F5 -3.175,-4.445; F6 -3.175,-3.175; F7 -3.175,-1.905; F8 -3.175,-0.635; F9 -3.175,0.635; F10 -3.175,1.905; F11 -3.175,3.175; F12 -3.175,4.445; F13 -3.175,5.715; F14 -3.175,6.985; F15 -3.175,8.255; F16 -3.175,9.525; G1 -1.905,-9.525; G2 -1.905,-8.255; G3 -1.905,-6.985; G4 -1.905,-5.715; G5 -1.905,-4.445; G6 -1.905,-3.175; G7 -1.905,-1.905; G8 -1.905,-0.635; G9 -1.905,0.635; G10 -1.905,1.905; G11 -1.905,3.175; G12 -1.905,4.445; G13 -1.905,5.715; G14 -1.905,6.985; G15 -1.905,8.255; G16 -1.905,9.525; H1 -0.635,-9.525; H2 -0.635,-8.255; H3 -0.635,-6.985; H4 -0.635,-5.715; H5 -0.635,-4.445; H6 -0.635,-3.175; H7 -0.635,-1.905; H8 -0.635,-0.635; H9 -0.635,0.635; H10 -0.635,1.905; H11 -0.635,3.175; H12 -0.635,4.445; H13 -0.635,5.715; H14 -0.635,6.985; H15 -0.635,8.255; H16 -0.635,9.525; J1 0.635,-9.525; J2 0.635,-8.255; J3 0.635,-6.985; J4 0.635,-5.715; J5 0.635,-4.445; J6 0.635,-3.175; J7 0.635,-1.905; J8 0.635,-0.635; J9 0.635,0.635; J10 0.635,1.905; J11 0.635,3.175; J12 0.635,4.445; J13 0.635,5.715; J14 0.635,6.985; J15 0.635,8.255; J16 0.635,9.525; K1 1.905,-9.525; K2 1.905,-8.255; K3 1.905,-6.985; K4 1.905,-5.715; K5 1.905,-4.445; K6 1.905,-3.175; K7 1.905,-1.905; K8 1.905,-0.635; K9 1.905,0.635; K10 1.905,1.905; K11 1.905,3.175; K12 1.905,4.445; K13 1.905,5.715; K14 1.905,6.985; K15 1.905,8.255; K16 1.905,9.525; L1 3.175,-9.525; L2 3.175,-8.255; L3 3.175,-6.985; L4 3.175,-5.715; L5 3.175,-4.445; L6 3.175,-3.175; L7 3.175,-1.905; L8 3.175,-0.635; L9 3.175,0.635; L10 3.175,1.905; L11 3.175,3.175; L12 3.175,4.445; L13 3.175,5.715; L14 3.175,6.985; L15 3.175,8.255; L16 3.175,9.525; M1 4.445,-9.525; M2 4.445,-8.255; M3 4.445,-6.985; M4 4.445,-5.715; M5 4.445,-4.445; M6 4.445,-3.175; M7 4.445,-1.905; M8 4.445,-0.635; M9 4.445,0.635; M10 4.445,1.905; M11 4.445,3.175; M12 4.445,4.445; M13 4.445,5.715; M14 4.445,6.985; M15 4.445,8.255; M16 4.445,9.525; N1 5.715,-9.525; N2 5.715,-8.255; N3 5.715,-6.985; N4 5.715,-5.715; N5 5.715,-4.445; N6 5.715,-3.175; N7 5.715,-1.905; N8 5.715,-0.635; N9 5.715,0.635; N10 5.715,1.905; N11 5.715,3.175; N12 5.715,4.445; N13 5.715,5.715; N14 5.715,6.985; N15 5.715,8.255; N16 5.715,9.525; P1 6.985,-9.525; P2 6.985,-8.255; P3 6.985,-6.985; P4 6.985,-5.715; P5 6.985,-4.445; P6 6.985,-3.175; P7 6.985,-1.905; P8 6.985,-0.635; P9 6.985,0.635; P10 6.985,1.905; P11 6.985,3.175; P12 6.985,4.445; P13 6.985,5.715; P14 6.985,6.985; P15 6.985,8.255; P16 6.985,9.525; R1 8.255,-9.525; R2 8.255,-8.255; R3 8.255,-6.985; R4 8.255,-5.715; R5 8.255,-4.445; R6 8.255,-3.175; R7 8.255,-1.905; R8 8.255,-0.635; R9 8.255,0.635; R10 8.255,1.905; R11 8.255,3.175; R12 8.255,4.445; R13 8.255,5.715; R14 8.255,6.985; R15 8.255,8.255; R16 8.255,9.525; T1 9.525,-9.525; T2 9.525,-8.255; T3 9.525,-6.985; T4 9.525,-5.715; T5 9.525,-4.445; T6 9.525,-3.175; T7 9.525,-1.905; T8 9.525,-0.635; T9 9.525,0.635; T10 9.525,1.905; T11 9.525,3.175; T12 9.525,4.445; T13 9.525,5.715; T14 9.525,6.985; T15 9.525,8.255; T16 9.525,9.525
SOT23-8_TI-DCN = smd 0.45 x 1.1: 1 -0.975,-1.3; 2 -0.325,-1.3; 3 0.325,-1.3; 4 0.975,-1.3; 5 0.975,1.3; 6 0.325,1.3; 7 -0.325,1.3; 8 -0.975,1.3
QFN65P400X400X80-17T210 = smd 1.01 x 0.32: 1 -1.86,0.975; 2 -1.86,0.325; 3 -1.86,-0.325; 4 -1.86,-0.975; 9 1.86,-0.975; 10 1.86,-0.325; 11 1.86,0.325; 12 1.86,0.975 | smd 0.32 x 1.01: 5 -0.975,-1.86; 6 -0.325,-1.86; 7 0.325,-1.86; 8 0.975,-1.86; 13 0.975,1.86; 14 0.325,1.86; 15 -0.325,1.86; 16 -0.975,1.86 | smd 2.1 x 2.1: EPAD 0,0
S-PVQFN-16 = smd 0.85 x 0.35: 1 -1.975,0.975; 2 -1.975,0.325; 3 -1.975,-0.325; 4 -1.975,-0.975; 9 1.975,-0.975; 10 1.975,-0.325; 11 1.975,0.325; 12 1.975,0.975 | smd 0.35 x 0.85: 5 -0.975,-1.975; 6 -0.325,-1.975; 7 0.325,-1.975; 8 0.975,-1.975; 13 0.975,1.975; 14 0.325,1.975; 15 -0.325,1.975; 16 -0.975,1.975 | smd 2.7 x 2.7: PAD 0,0
SOT23' = smd 1 x 1.4: 1 -0.95,-1.1; 2 0.95,-1.1; 3 0,1.1
CRYSTAL_2.5X2 = smd 0.9 x 0.8: 1 -0.825,-0.625; 2 0.825,-0.625; 3 0.825,0.625; 4 -0.825,0.625

### Placement (x,y rotation side)
C1  47.3,68.9 90 top
C2  25,66.2 180 top
C3  9.82,70 0 top
C4  23.3,71.8 270 top
C5  26,68.5 180 top
C6  51.3,66.3 0 top
C7  21.5,71.6 270 top
C8  55.7,69.7 90 top
C9  5.92,77.8 180 top
C10  16.2,75.6 180 top
C11  11.82,68.9 270 top
C12  20.8,67.7 90 top
C16  10.62,67 90 top
C17  9.18,77 270 top
C22  5.62,71.1 180 top
CM1  71.9,90.7 0 top
CM2  77.9,90.7 0 top
CM3  83.9,90.7 0 top
D1  17,15 180 top
D2  17,13 180 top
D3  17,17 180 top
D4  47.9,63.4 180 top
H1  93,6 0 top
H2  93,89 0 top
H3  6,89 0 top
H4  6,6 0 top
J1  21.9,87.99 0 top
J2  71.9,82.2 90 top
J3  77.9,82.2 90 top
J4  83.9,82.2 90 top
J5  13.72,26.8 270 top
J6  49.9,87.99 0 top
J7  20.5,7 180 top
JP1  36.83,5.08 0 top
JP3  25.4,38.1 90 top
JP4  13.72,49.4 270 top
JP5  25.4,50.8 270 top
JP6  25.4,22.86 90 top
JP8  19,25.5 180 top
JP9  22,82.8 180 top
JP10  41.91,80.01 180 top
JP11  57.15,80.01 180 top
L2  17.6,67.1 0 top
Q1  52,69.2 90 top
Q3  23.1,75.4 0 top
Q4  32,77.4 0 top
Q5  36,73.1 90 top
Q6  38.4,67.7 0 top
R1  20,15 0 top
R2  20,13 0 top
R3  20,17 0 top
R4  48.9,66.6 180 top
R5  47.3,74.1 180 top
R6  49.2,75.1 180 top
R7  18.6,78.4 180 top
R8  47.3,75.1 0 top
R9  49.2,74.1 0 top
R10  22.4,78.4 180 top
R11  43.4,74.1 180 top
R12  48.2,64.9 180 top
R13  45.4,75.1 180 top
R14  43.4,75.1 0 top
R15  53.7,65.8 90 top
R16  51.3,71.8 0 top
R17  7.8,71 90 top
R18  54.7,69.7 270 top
R19  45.4,74.1 0 top
R20  39.6,74.1 180 top
R21  41.5,75.1 180 top
R22  39.6,75.1 0 top
R23  41.5,74.1 0 top
R24  48.8,70.5 180 top
R25  48.8,71.5 180 top
R26  46.5,66.6 0 top
R27  34.6,75.1 90 top
R28  38.2,72.7 270 top
R29  27.6,77.5 180 top
R30  39.8,70.1 90 top
R31  31.5,72.7 180 top
R32  34.6,67.4 180 top
R33  34.1,64.9 270 top
R34  34.6,66.4 180 top
R35  25.5,75.4 90 top
R36  26.9,66.2 180 top
R37  26,67.2 180 top
R38  36.2,68.3 270 top
R39  30.6,13.6 0 top
TP1  48.8,69 0 top
TP2  41,67.4 0 top
TP3  41,65.6 0 top
TP4  42.7,65.6 0 top
TP5  44.4,65.6 0 top
TP6  33,71.8 0 top
TP8  36.6,70.6 0 top
TP9  20.5,76.6 0 top
TP10  46.1,65.1 0 top
TP11  35.6,64.9 0 top
TP12  34.9,69.5 0 top
TP13  40.2,72 90 top
TP14  38.3,70.6 0 top
TP15  7.12,68.8 270 top
TP16  14.7,70 180 top
TP17  14.2,66.2 180 top
TP18  37.1,75.8 0 top
TP19  20.5,78.4 0 top
TP20  51.6,75.5 0 top
TP_CORE  63.4,41.3 180 top
TP_DDR  63.3,47.1 180 top
TP_MPU  63.3,54.7 180 top
TP_PLL  63.3,58.5 180 top
U1  40.8,51 0 top
U2  11.88,77 270 top
U3  44.1,69.7 270 top
U4  30.5,69.2 0 top
U5  17.6,72.4 180 top
U7  MCP1703A  [SOT23']  26,71.5 0 top
U$1  0,0 0 top
X1  10.62,72.1 0 top

### Tracks (layer width: path | path; a pad name or v marks a point on that pad's centre or on a via)
3.3V  (21 unrouted)
  pour Top (no thermals): 4.42,78.2 4.42,77.4 5.72,77.4 5.72,78.2
!FAULT  (3 unrouted)
!SHUTDOWN  (4 unrouted)
+3V3  (21 unrouted)
AD0  (4 unrouted)
AD1  (4 unrouted)
AD2  (4 unrouted)
AUX_!SHUTDOWN  (2 unrouted)
AUX_CAN1_H  (2 unrouted)
AUX_CAN1_L  (2 unrouted)
AUX_CAN2_H  (2 unrouted)
AUX_CAN2_L  (2 unrouted)
AUX_GND1  (2 unrouted)
AUX_GND2  (2 unrouted)
AUX_GND3  (2 unrouted)
AUX_VBUS1  (2 unrouted)
AUX_VBUS2  (2 unrouted)
BOOT  (1 unrouted)
CAN1_H  (5 unrouted)
CAN1_L  (5 unrouted)
CAN2_H  (2 unrouted)
CAN2_L  (2 unrouted)
CB-RESET  (3 unrouted)
CB_CTRL  (5 unrouted)
CRYSTALIN  (1 unrouted)
CRYSTALOUT  (1 unrouted)
GND  (via drill 0.25)  (4 unrouted)
  other vias: 92.5,91.5
  pour Top (isolate 0.2, rank 6): 0,0 100.1,0 100.1,95.3 0,95.3
  pour Bottom (isolate 0.2, rank 6): 0,0 100,0 100,95 0,95
MAX4211-3V3  (2 unrouted)
N$1  (1 unrouted)
N$2  (1 unrouted)
N$3  (1 unrouted)
N$4  (1 unrouted)
N$5  (1 unrouted)
N$6  (3 unrouted)
N$7  (3 unrouted)
N$8  (2 unrouted)
N$9  (2 unrouted)
N$10  (2 unrouted)
N$11  (1 unrouted)
N$12  (1 unrouted)
N$13  (1 unrouted)
N$14  (1 unrouted)
N$15  (1 unrouted)
N$16  (1 unrouted)
N$17  (1 unrouted)
N$19  (1 unrouted)
N$20  (1 unrouted)
N$21  (1 unrouted)
N$270  (1 unrouted)
N$271  (1 unrouted)
N$300  (1 unrouted)
N$398  (3 unrouted)
  pour Top (no thermals): 23.7,75.7 26.9,75.7 26.9,79.1 23.7,79.1
N$406  (1 unrouted)
N$480  (1 unrouted)
N$482  (1 unrouted)
N$518  (1 unrouted)
N$523  (1 unrouted)
N$573  (2 unrouted)
N$575  (1 unrouted)
N$579  (2 unrouted)
N$580  (3 unrouted)
N$581  (3 unrouted)
N$589  (1 unrouted)
N$590  (2 unrouted)
N$593  (1 unrouted)
  pour Top (no thermals): 32.3,79.1 32.3,75.5 28.3,75.5 28.3,79.1
N$596  (3 unrouted)
N$597  (3 unrouted)
N$598  (1 unrouted)
N$599  (2 unrouted)
N$600  (1 unrouted)
N$603  (2 unrouted)
N$604  (1 unrouted)
ON/!OFF  (3 unrouted)
OPD_PWR  (2 unrouted)
OPD_SCL  (2 unrouted)
OPD_SDA  (2 unrouted)
PA0  (1 unrouted)
PA2/USART2_TX  (1 unrouted)
PA3/USART2_RX  (1 unrouted)
PEN-SCL-FILT  (5 unrouted)
PEN-SDA-FILT  (6 unrouted)
RF1  (1 unrouted)
RF2  (1 unrouted)
SPARE1  (2 unrouted)
SPARE2  (2 unrouted)
SPARE3  (2 unrouted)
SPARE4  (2 unrouted)
SPARE5  (2 unrouted)
SPARE6  (2 unrouted)
SPARE7  (2 unrouted)
TPS62111-PG  (1 unrouted)
TPS62111-SYNC  (3 unrouted)
TPS62111_SW
  pour Top (no thermals): 17.9,70.7 17.3,70.7 17.3,68.5 17.9,68.5
VBUS  (2 unrouted)
  pour Top (isolate 0.2, no thermals): 48,77.73 48,81.93 47.3,82.57 47.3,90.1 44.9,90.1 44.9,82.88 43.5,81.73 43.5,77.73
  pour Top (isolate 0.2, no thermals): 45.1,77.36 45.1,75.34 47.3,75.34 47.3,77.36
VBUSP  (8 unrouted)
  pour Top (no thermals): 23.3,73.7 23.3,77.1 16.2,77.1 16.2,74.1 19.3,74.1 19.3,72 22.5,72 22.5,73.7
VPD  (11 unrouted)

### Text on the board
tPlace: C2L | 2 | 4 | 6 | 10 | 9 | 8 | 7 | 6 | 5 | 4 | 3 | 2 | 1 | C2H | 1 | 3 | 5 | 7 | PB7/SD | PA0 | PB6/CL | PA1 | PB5 | PA2/TX | PB4 | PA3/RX | PB3 | PA4 | PA15 | PA5 | +3.3V | PA8 | PA6 | GND | PA7 | GND | PB0 | PB1 | VBUS | FTDI VUSB / to VBUS | +3.3V | OreSat Proto-Card v3.1 | 2019/02/20 | PA0 | VBUSP | 3.3V | CAN1H | CAN1L | !SHDN | 3.3V | VBUS